# EAGLE design Stamp 1d (EAGLE 6.2)

## Sheet 1 of 5
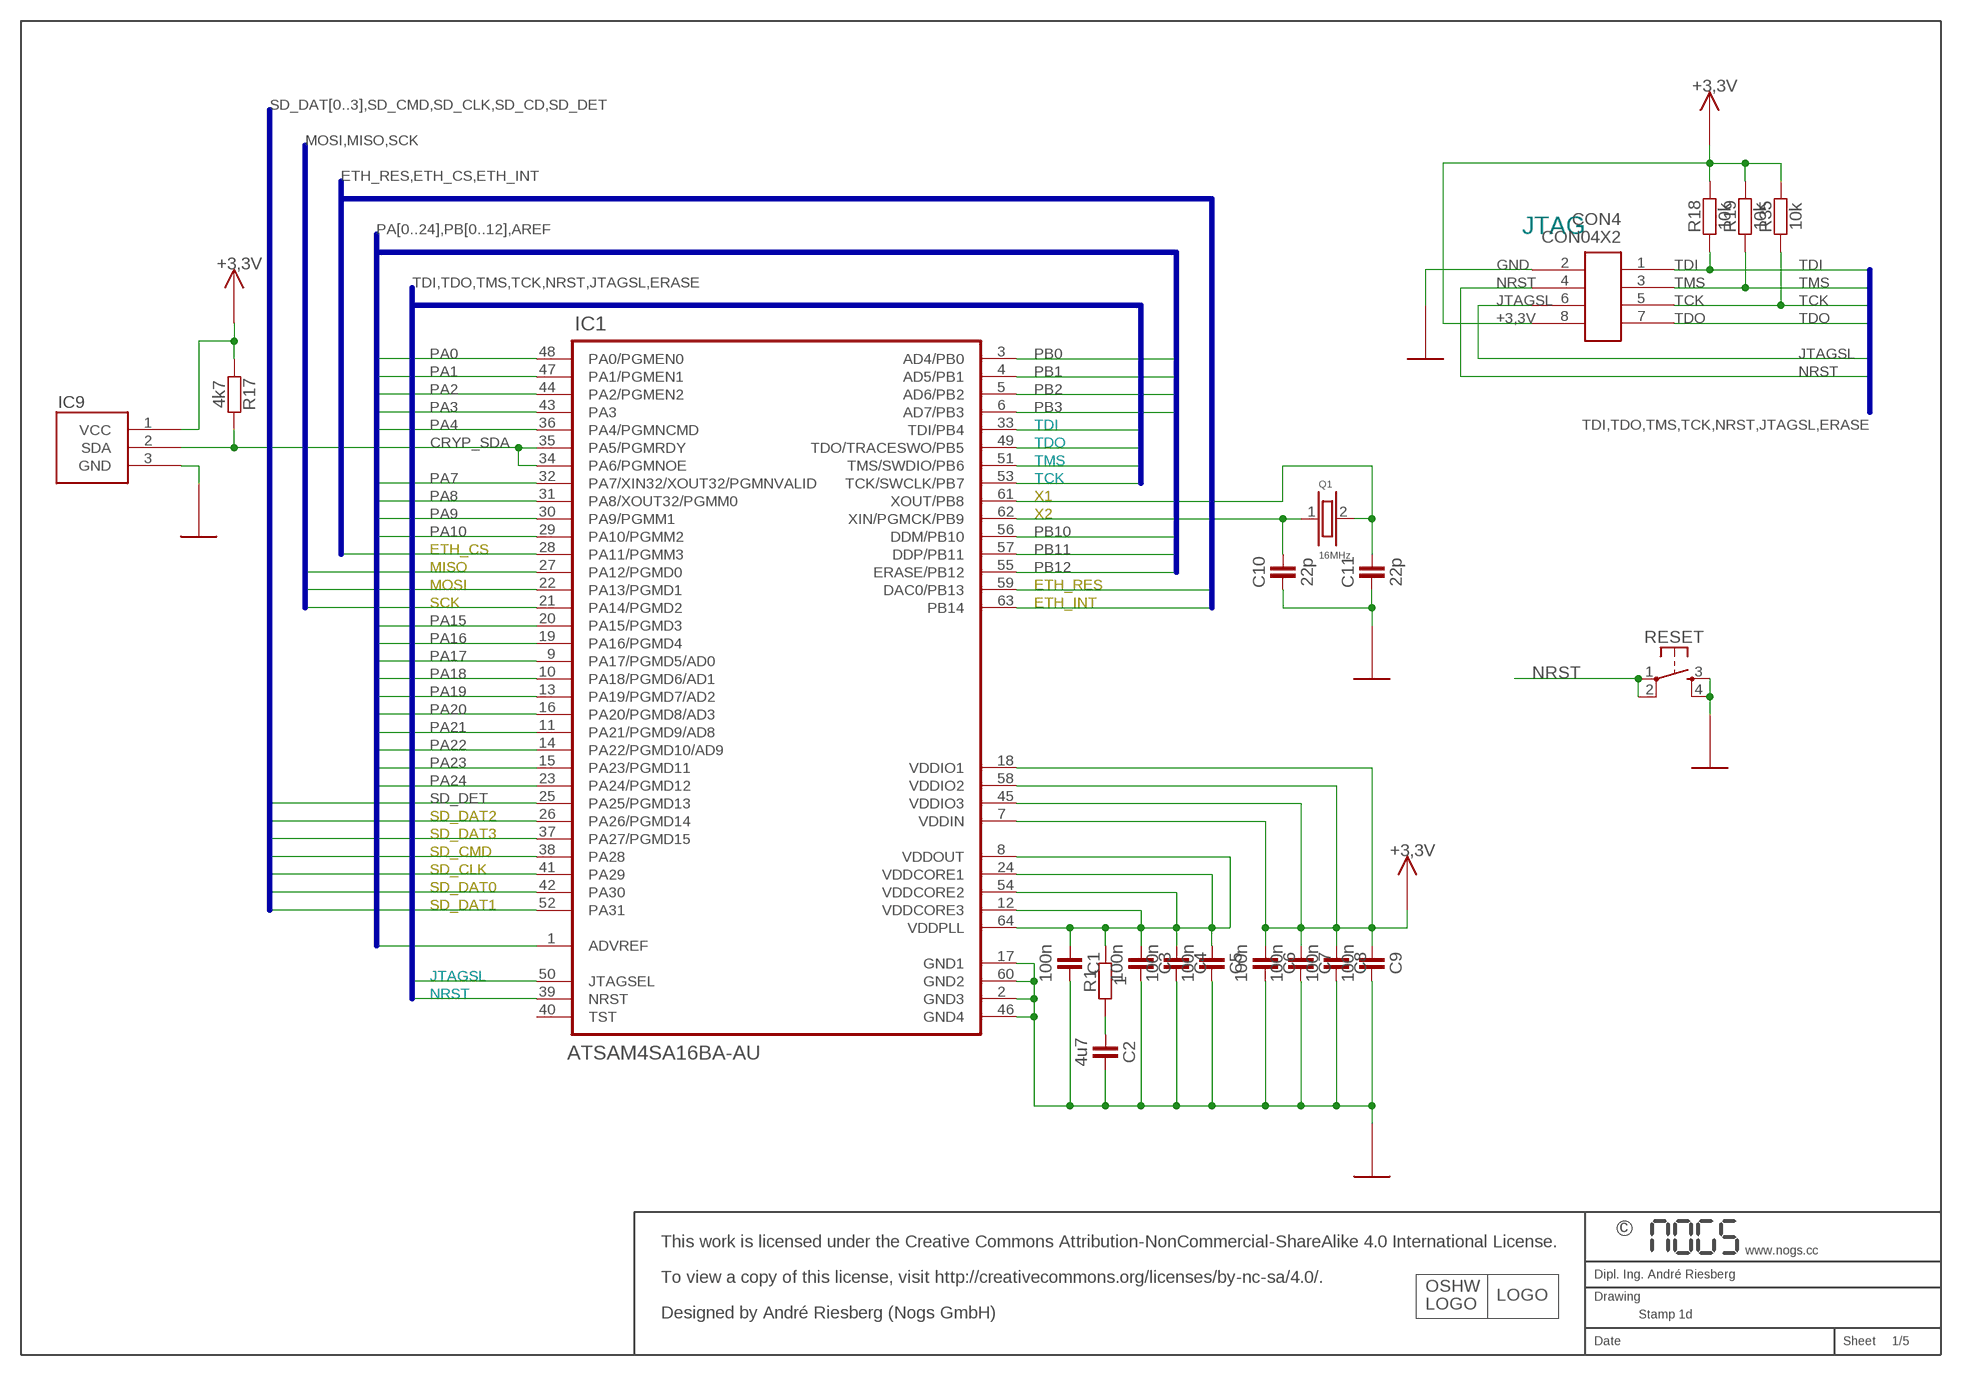
[diagram p0: schematic, sheet 1]

### Parts
C1  100n  CAPACITOR-C0402  [R0402]
C2  4u7  CAPACITOR-C0402  [R0402]
C3  100n  CAPACITOR-C0402  [R0402]
C4  100n  CAPACITOR-C0402  [R0402]
C5  100n  CAPACITOR-C0402  [R0402]
C6  100n  CAPACITOR-C0402  [R0402]
C7  100n  CAPACITOR-C0402  [R0402]
C8  100n  CAPACITOR-C0402  [R0402]
C9  100n  CAPACITOR-C0402  [R0402]
C10  22p  CAPACITOR-C0402  [R0402]
C11  22p  CAPACITOR-C0402  [R0402]
CON4  CON04X2  [CON04X2]
IC1  ATSAM4SA16BA-AU  ATSAM4S16BA-AU  [QFP50P1200X1200X160-64N]
IC9  SHA240-1  [SOT-23]
Q1  16MHz  Q@2  [TXC1]
R1  1  RESISTOR-R0402  [R0402]
R17  4k7  RESISTOR-R0402  [R0402]
R18  10k  RESISTOR-R0402  [R0402]
R19  10k  RESISTOR-R0402  [R0402]
R35  10k  RESISTOR-R0402  [R0402]
RESET  SW-TACTILE-PTS840P  [SW_PTS840P]

### Nets
+1,8V_A: C1.1 C3.1 C4.1 C5.1 IC1.8(VDDOUT) IC1.12(VDDCORE3) IC1.24(VDDCORE1) IC1.54(VDDCORE2) IC1.64(VDDPLL) R1.2
+3,3V: C6.1 C7.1 C8.1 C9.1 CON4.8 IC1.7(VDDIN) IC1.18(VDDIO1) IC1.45(VDDIO3) IC1.58(VDDIO2) IC9.1(VCC) R17.1 R18.2 R19.2 R35.2 ; also sheet 2,3,4,5
AREF: IC1.1(ADVREF) ; also sheet 5
CRYP_SDA: IC1.34(PA6/PGMNOE) IC1.35(PA5/PGMRDY) IC9.2(SDA) R17.2
ETH_CS: IC1.28(PA11/PGMM3) ; also sheet 2
ETH_INT: IC1.63(PB14) ; also sheet 2
ETH_RES: IC1.59(DAC0/PB13) ; also sheet 2
GND: C1.2 C2.2 C3.2 C4.2 C5.2 C6.2 C7.2 C8.2 C9.2 C10.1 C11.1 CON4.2 IC1.2(GND3) IC1.17(GND1) IC1.46(GND4) IC1.60(GND2) IC9.3(GND) RESET.3(S1) RESET.4(S2) ; also sheet 2,3,4,5
JTAGSL: CON4.6 IC1.50(JTAGSEL)
MISO: IC1.27(PA12/PGMD0) ; also sheet 2
MOSI: IC1.22(PA13/PGMD1) ; also sheet 2
N$10: C2.1 R1.1
NRST: CON4.4 IC1.39(NRST) RESET.1 RESET.2
PA0: IC1.48(PA0/PGMEN0) ; also sheet 5
PA1: IC1.47(PA1/PGMEN1) ; also sheet 5
PA2: IC1.44(PA2/PGMEN2) ; also sheet 5
PA3: IC1.43(PA3) ; also sheet 5
PA4: IC1.36(PA4/PGMNCMD) ; also sheet 5
PA7: IC1.32(PA7/XIN32/XOUT32/PGMNVALID) ; also sheet 5
PA8: IC1.31(PA8/XOUT32/PGMM0) ; also sheet 5
PA9: IC1.30(PA9/PGMM1) ; also sheet 5
PA10: IC1.29(PA10/PGMM2) ; also sheet 5
PA15: IC1.20(PA15/PGMD3) ; also sheet 5
PA16: IC1.19(PA16/PGMD4) ; also sheet 5
PA17: IC1.9(PA17/PGMD5/AD0) ; also sheet 5
PA18: IC1.10(PA18/PGMD6/AD1) ; also sheet 5
PA19: IC1.13(PA19/PGMD7/AD2) ; also sheet 5
PA20: IC1.16(PA20/PGMD8/AD3) ; also sheet 5
PA21: IC1.11(PA21/PGMD9/AD8) ; also sheet 5
PA22: IC1.14(PA22/PGMD10/AD9) ; also sheet 5
PA23: IC1.15(PA23/PGMD11) ; also sheet 5
PA24: IC1.23(PA24/PGMD12) ; also sheet 5
PB0: IC1.3(AD4/PB0) ; also sheet 5
PB1: IC1.4(AD5/PB1) ; also sheet 5
PB2: IC1.5(AD6/PB2) ; also sheet 5
PB3: IC1.6(AD7/PB3) ; also sheet 5
PB10: IC1.56(DDM/PB10) ; also sheet 5
PB11: IC1.57(DDP/PB11) ; also sheet 5
PB12: IC1.55(ERASE/PB12) ; also sheet 5
SCK: IC1.21(PA14/PGMD2) ; also sheet 2
SD_CLK: IC1.41(PA29) ; also sheet 3
SD_CMD: IC1.38(PA28) ; also sheet 3
SD_DAT0: IC1.42(PA30) ; also sheet 3
SD_DAT1: IC1.52(PA31) ; also sheet 3
SD_DAT2: IC1.26(PA26/PGMD14) ; also sheet 3
SD_DAT3: IC1.37(PA27/PGMD15) ; also sheet 3
SD_DET: IC1.25(PA25/PGMD13) ; also sheet 3
TCK: CON4.5 IC1.53(TCK/SWCLK/PB7) R35.1
TDI: CON4.1 IC1.33(TDI/PB4) R18.1
TDO: CON4.7 IC1.49(TDO/TRACESWO/PB5)
TMS: CON4.3 IC1.51(TMS/SWDIO/PB6) R19.1
X1: C11.2 IC1.61(XOUT/PB8) Q1.2
X2: C10.2 IC1.62(XIN/PGMCK/PB9) Q1.1
Unconnected: IC1.40(TST)

### Buses
TDI,TDO,TMS,TCK,NRST,JTAGSL,ERASE
PA[0..24],PB[0..12],AREF
MOSI,MISO,SCK
ETH_RES,ETH_CS,ETH_INT
SD_DAT[0..3],SD_CMD,SD_CLK,SD_CD,SD_DET

### Notes on the sheet
- JTAG
- F1841946
- This work is licensed under the Creative Commons Attribution-NonCommercial-ShareAlike 4.0 International License.
- To view a copy of this license, visit http://creativecommons.org/licenses/by-nc-sa/4.0/.
- OSHW
- LOGO
- LOGO
- Designed by André Riesberg (Nogs GmbH)

## Sheet 2 of 5
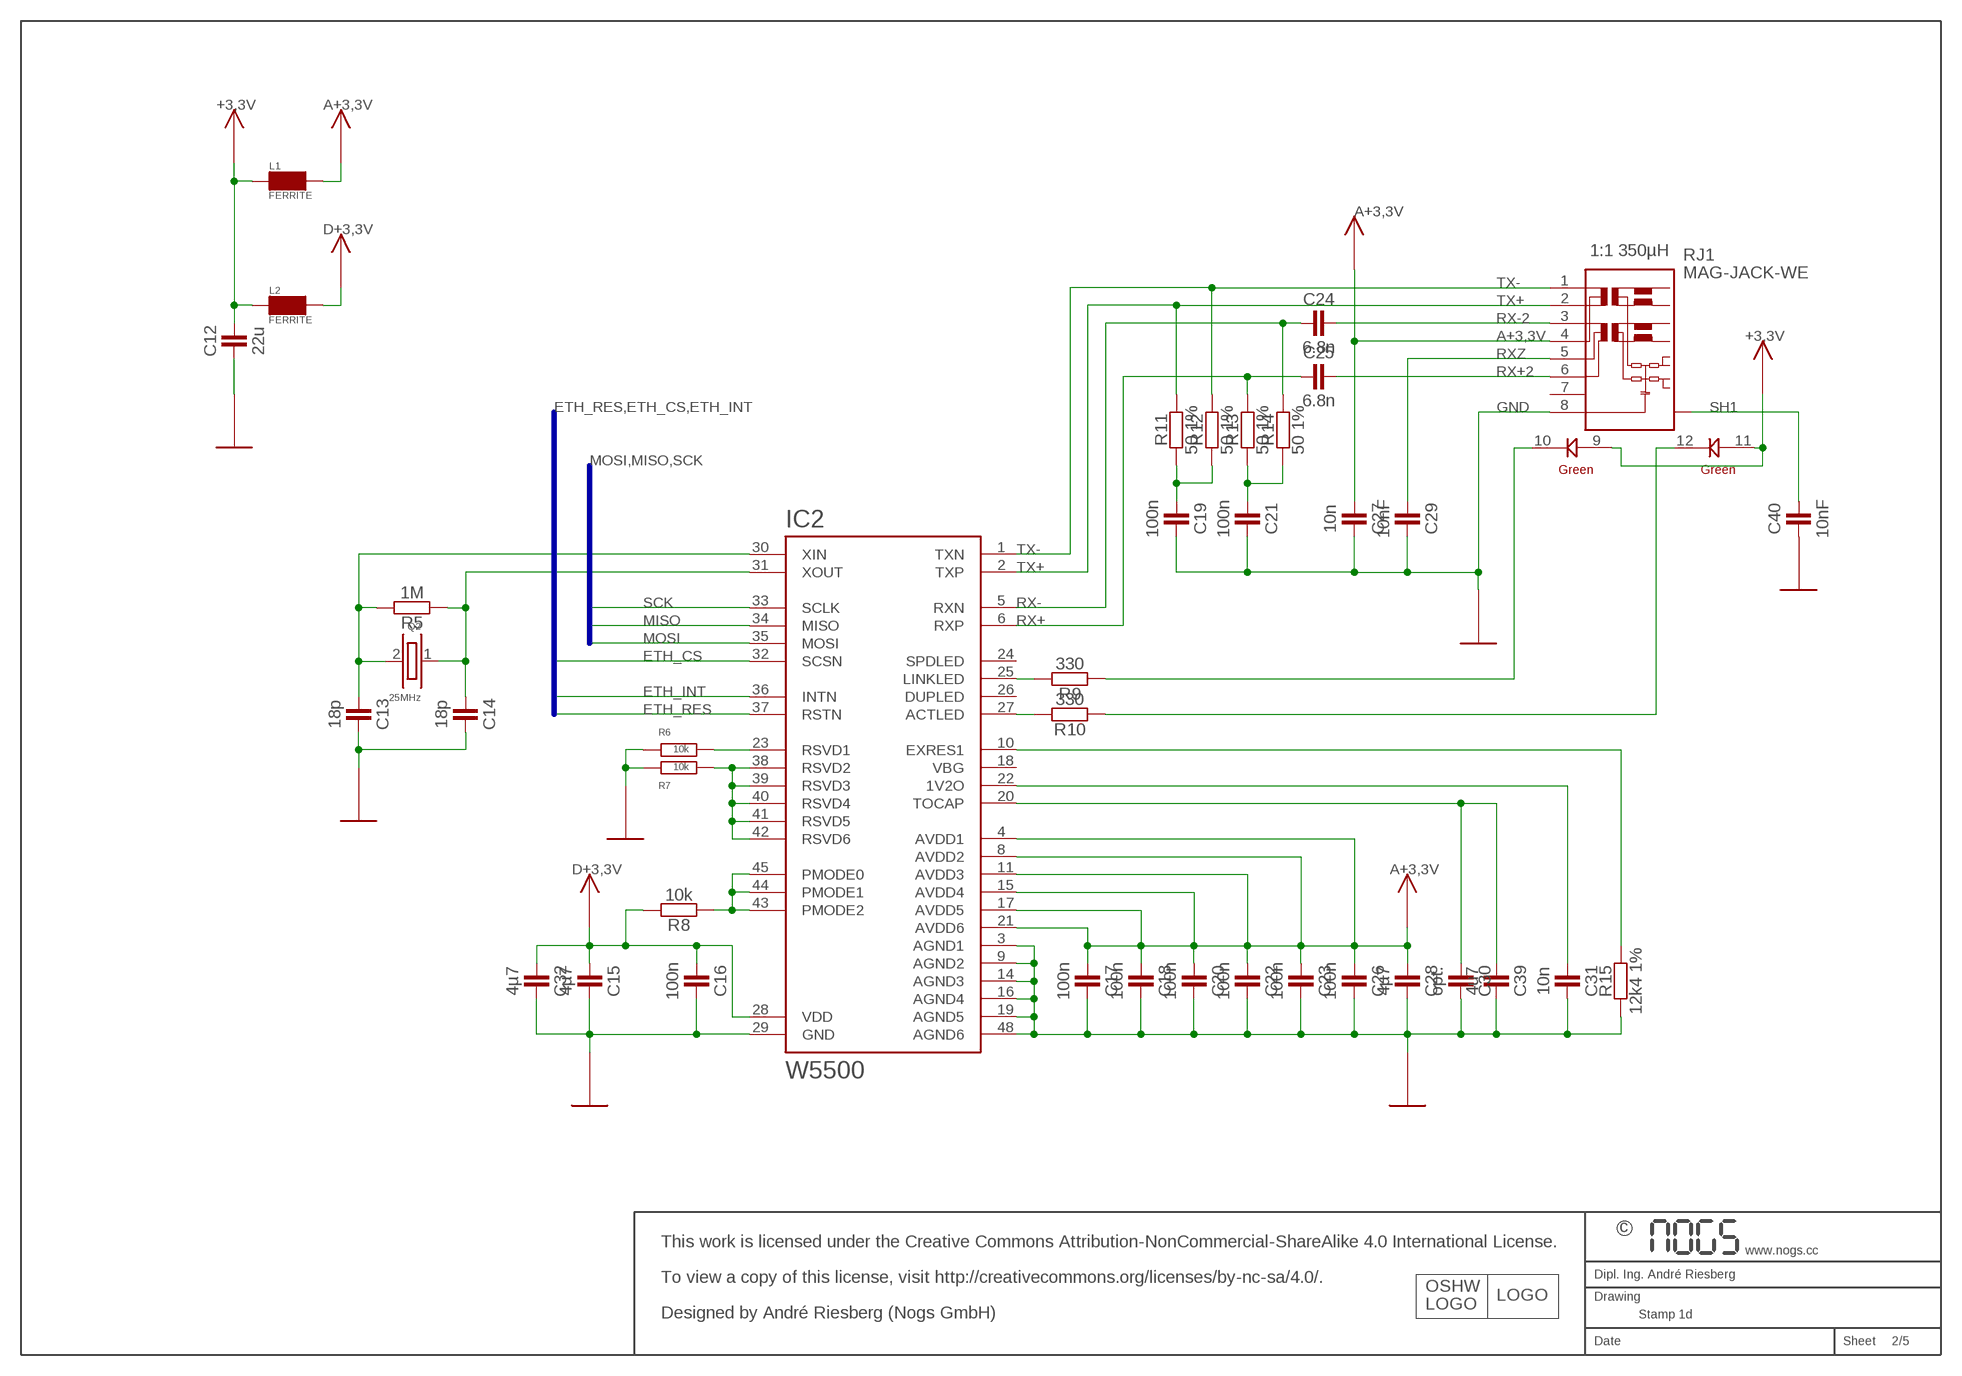
[diagram p1: schematic, sheet 2]

### Parts
C12  22u  CAPACITOR-C1206  [R1206]
C13  18p  CAPACITOR-C0402  [R0402]
C14  18p  CAPACITOR-C0402  [R0402]
C15  4µ7  CAPACITOR-C0402  [R0402]
C16  100n  CAPACITOR-C0402  [R0402]
C17  100n  CAPACITOR-C0402  [R0402]
C18  100n  CAPACITOR-C0402  [R0402]
C19  100n  CAPACITOR-C0402  [R0402]
C20  100n  CAPACITOR-C0402  [R0402]
C21  100n  CAPACITOR-C0402  [R0402]
C22  100n  CAPACITOR-C0402  [R0402]
C23  100n  CAPACITOR-C0402  [R0402]
C24  6.8n  CAPACITOR-C0402  [R0402]
C25  6.8n  CAPACITOR-C0402  [R0402]
C26  100n  CAPACITOR-C0402  [R0402]
C27  10n  CAPACITOR-C0402  [R0402]
C28  4µ7  CAPACITOR-C0402  [R0402]
C29  10nF  CAPACITOR-C0402  [R0402]
C30  opt.  CAPACITOR-C0402  [R0402]
C31  10n  CAPACITOR-C0402  [R0402]
C32  4µ7  CAPACITOR-C0402  [R0402]
C39  4u7  CAPACITOR-C0402  [R0402]
C40  10nF  CAPACITOR-C0402  [R0402]
IC2  W5500  [LQFP-48]
L1  FERRITE  L1008@2  [1206@2]
L2  FERRITE  L1008@2  [1206@2]
Q2  25MHz  Q@2  [TXC1]
R5  1M  RESISTOR-R0402  [R0402]
R6  10k  RESISTOR-R0402  [R0402]
R7  10k  RESISTOR-R0402  [R0402]
R8  10k  RESISTOR-R0402  [R0402]
R9  330  RESISTOR-R0402  [R0402]
R10  330  RESISTOR-R0402  [R0402]
R11  50 1%  RESISTOR-R0402  [R0402]
R12  50 1%  RESISTOR-R0402  [R0402]
R13  50 1%  RESISTOR-R0402  [R0402]
R14  50 1%  RESISTOR-R0402  [R0402]
R15  12k4 1%  RESISTOR-R0402  [R0402]
RJ1  MAG-JACK-WE  [7499011121A]

### Nets
+3,3V: C12.2 L1.1 L2.1 RJ1.9 RJ1.11 ; also sheet 1,3,4,5
A+3,3V: C17.1 C18.1 C20.1 C22.1 C23.1 C26.1 C27.1 C28.1 IC2.4(AVDD1) IC2.8(AVDD2) IC2.11(AVDD3) IC2.15(AVDD4) IC2.17(AVDD5) IC2.21(AVDD6) L1.2 RJ1.4 ; supply symbol labelled +3,3V
D+3,3V: C15.1 C16.1 C32.1 IC2.28(VDD) L2.2 R8.2 ; supply symbol labelled +3,3V
ETH_CS: IC2.32(SCSN) ; also sheet 1
ETH_INT: IC2.36(INTN) ; also sheet 1
ETH_RES: IC2.37(RSTN) ; also sheet 1
GND: C12.1 C13.1 C14.1 C15.2 C16.2 C17.2 C18.2 C19.2 C20.2 C21.2 C22.2 C23.2 C26.2 C27.2 C28.2 C29.2 C30.2 C31.2 C32.2 C39.2 C40.1 IC2.3(AGND1) IC2.9(AGND2) IC2.14(AGND3) IC2.16(AGND4) IC2.19(AGND5) IC2.29(GND) IC2.48(AGND6) R6.2 R7.2 R15.1 RJ1.8 ; also sheet 1,3,4,5
MISO: IC2.34(MISO) ; also sheet 1
MOSI: IC2.35(MOSI) ; also sheet 1
N$1: IC2.25(LINKLED) R9.2
N$2: IC2.43(PMODE2) IC2.44(PMODE1) IC2.45(PMODE0) R8.1
N$4: C14.2 IC2.31(XOUT) Q2.1 R5.2
N$5: C13.2 IC2.30(XIN) Q2.2 R5.1
N$6: IC2.23(RSVD1) R6.1
N$7: IC2.27(ACTLED) R10.2
N$11: IC2.38(RSVD2) IC2.39(RSVD3) IC2.40(RSVD4) IC2.41(RSVD5) IC2.42(RSVD6) R7.1
N$16: IC2.10(EXRES1) R15.2
N$17: C31.1 IC2.22(1V2O)
N$18: C30.1 C39.1 IC2.20(TOCAP)
N$19: C19.1 R11.1 R12.1
N$21: C21.1 R13.1 R14.1
N$26: R9.1 RJ1.10
N$27: R10.1 RJ1.12
RX+: C25.1 IC2.6(RXP) R13.2
RX+2: C25.2 RJ1.6
RX-: C24.1 IC2.5(RXN) R14.2
RX-2: C24.2 RJ1.3
RXZ: C29.1 RJ1.5
SCK: IC2.33(SCLK) ; also sheet 1
SH1: C40.2 RJ1.SH@1(S) RJ1.SH@2(S)
TX+: IC2.2(TXP) R11.2 RJ1.2
TX-: IC2.1(TXN) R12.2 RJ1.1
Unconnected: IC2.24(SPDLED) IC2.26(DUPLED) RJ1.7

### Buses
MOSI,MISO,SCK
ETH_RES,ETH_CS,ETH_INT

### Notes on the sheet
- FAIR RITE
- 1:1 350µH
- 2512067007Y3
- F1841954
- This work is licensed under the Creative Commons Attribution-NonCommercial-ShareAlike 4.0 International License.
- To view a copy of this license, visit http://creativecommons.org/licenses/by-nc-sa/4.0/.
- OSHW
- LOGO
- LOGO
- Designed by André Riesberg (Nogs GmbH)

## Sheet 3 of 5
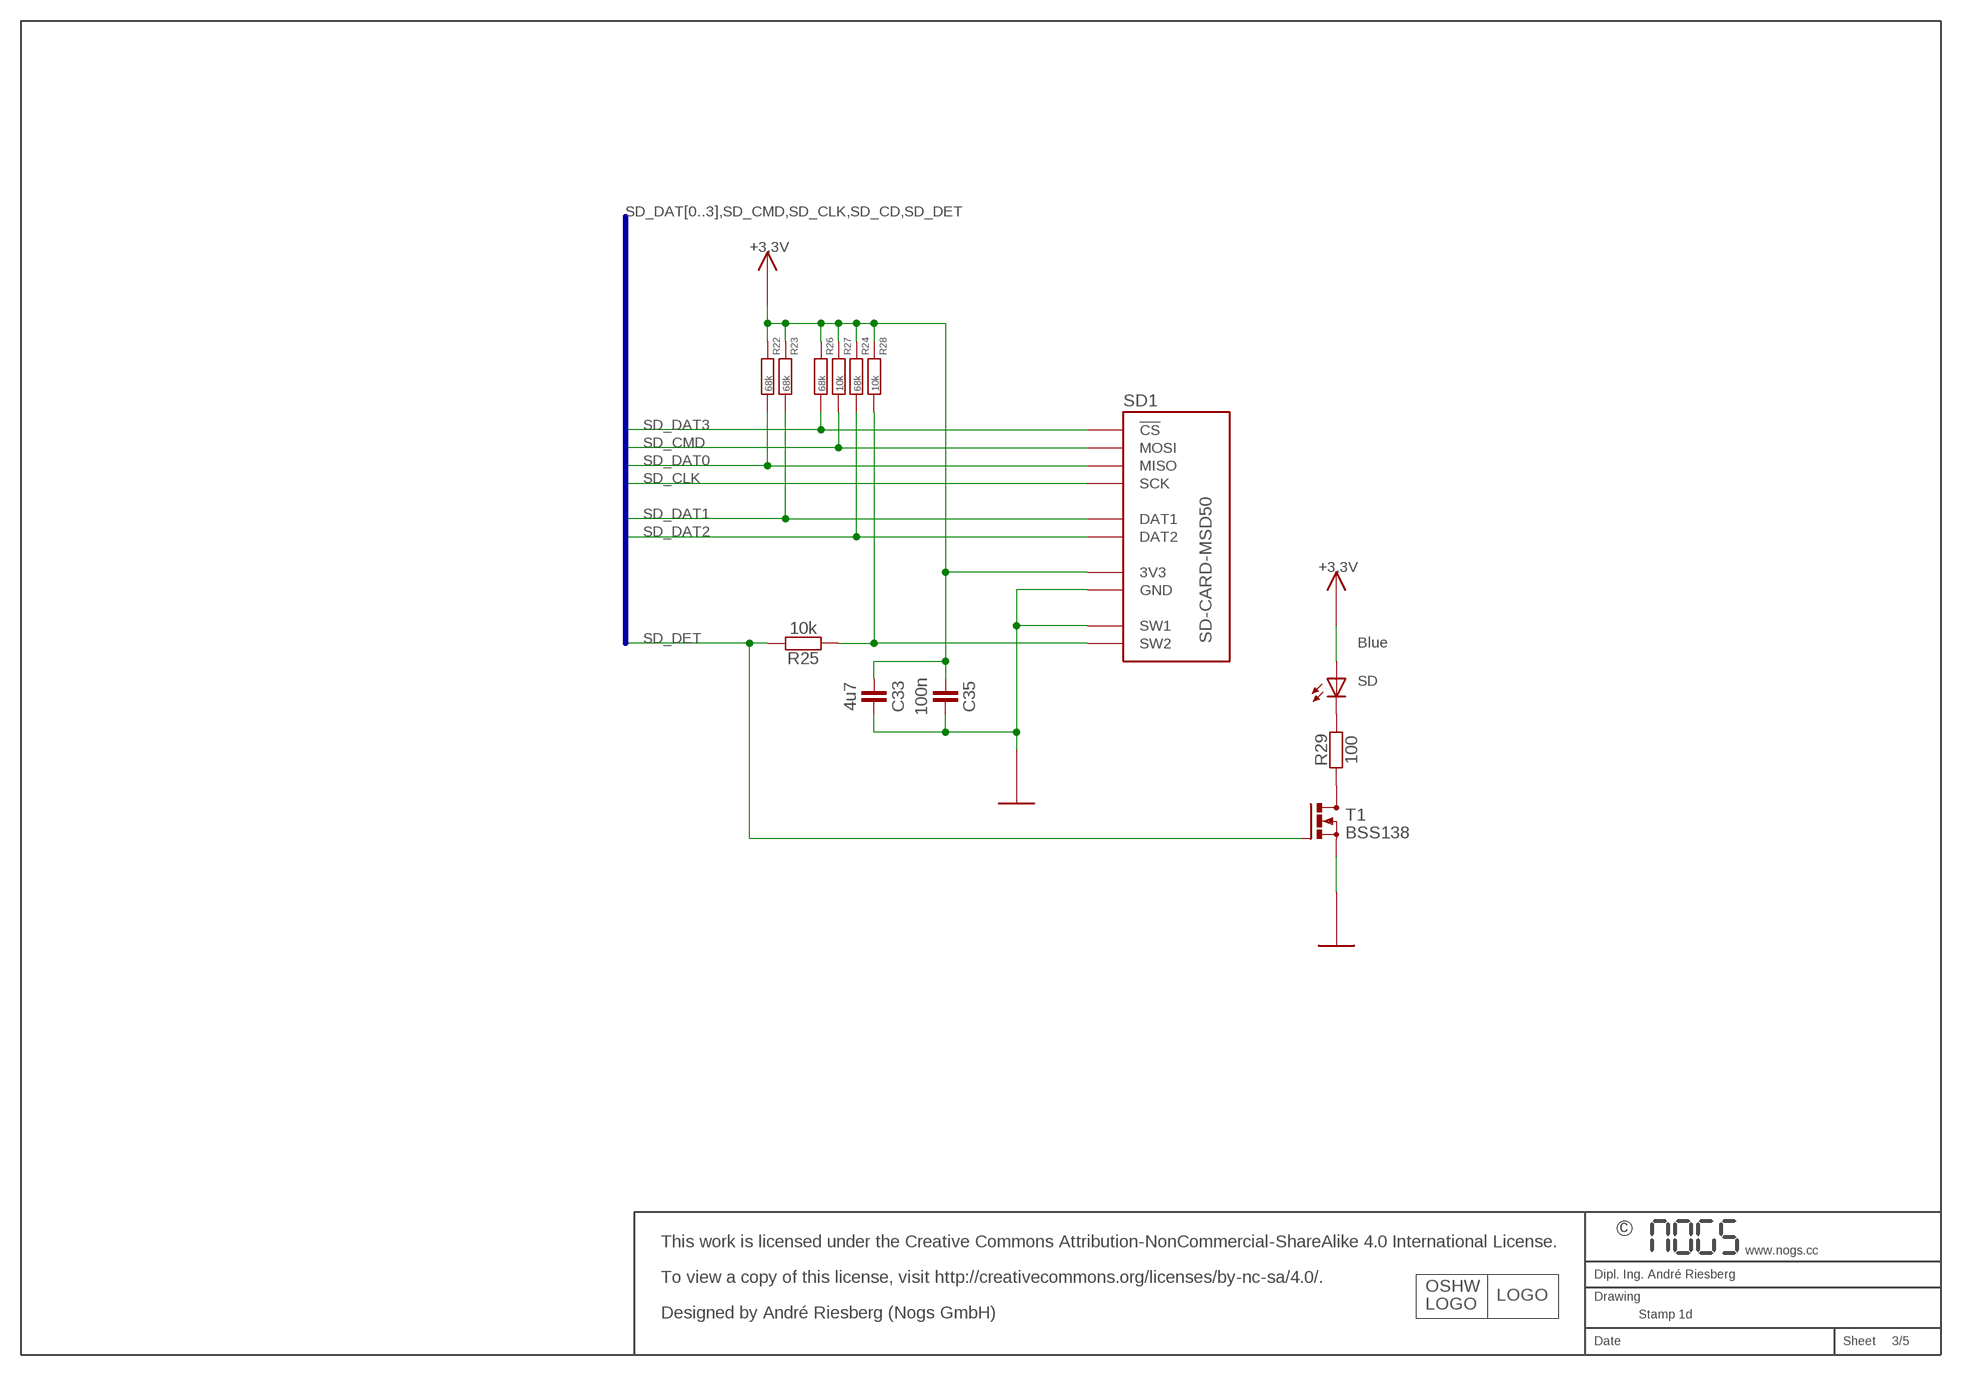
[diagram p2: schematic, sheet 3]

### Parts
C33  4u7  CAPACITOR-C0402  [R0402]
C35  100n  CAPACITOR-C0402  [R0402]
R22  68k  RESISTOR-R0402  [R0402]
R23  68k  RESISTOR-R0402  [R0402]
R24  68k  RESISTOR-R0402  [R0402]
R25  10k  RESISTOR-R0402  [R0402]
R26  68k  RESISTOR-R0402  [R0402]
R27  10k  RESISTOR-R0402  [R0402]
R28  10k  RESISTOR-R0402  [R0402]
R29  100  RESISTOR-R0402  [R0402]
SD  Blue  LED-0603  [LED_0603]
SD1  SD-CARD-MSD50  [SD_5031821853]
T1  BSS138  MOSFET-N-SOT23  [SOT23]

### Nets
+3,3V: C33.1 C35.1 R22.2 R23.2 R24.2 R26.2 R27.2 R28.2 SD1.VCC(3V3) SD.A ; also sheet 1,2,4,5
GND: C33.2 C35.2 SD1.GND SD1.SW1 T1.2(S) ; also sheet 1,2,4,5
N$3: R29.1 T1.3(D)
N$40: R29.2 SD.C
N$41: R25.1 R28.1 SD1.SW2
SD_CLK: SD1.SCK ; also sheet 1
SD_CMD: R27.1 SD1.MOSI ; also sheet 1
SD_DAT0: R22.1 SD1.MISO ; also sheet 1
SD_DAT1: R23.1 SD1.DAT1 ; also sheet 1
SD_DAT2: R24.1 SD1.DAT2 ; also sheet 1
SD_DAT3: R26.1 SD1.CS(!CS) ; also sheet 1
SD_DET: R25.2 T1.1(G) ; also sheet 1

### Buses
SD_DAT[0..3],SD_CMD,SD_CLK,SD_CD,SD_DET

### Notes on the sheet
- RESET
- This work is licensed under the Creative Commons Attribution-NonCommercial-ShareAlike 4.0 International License.
- To view a copy of this license, visit http://creativecommons.org/licenses/by-nc-sa/4.0/.
- OSHW
- LOGO
- LOGO
- Designed by André Riesberg (Nogs GmbH)

## Sheet 4 of 5
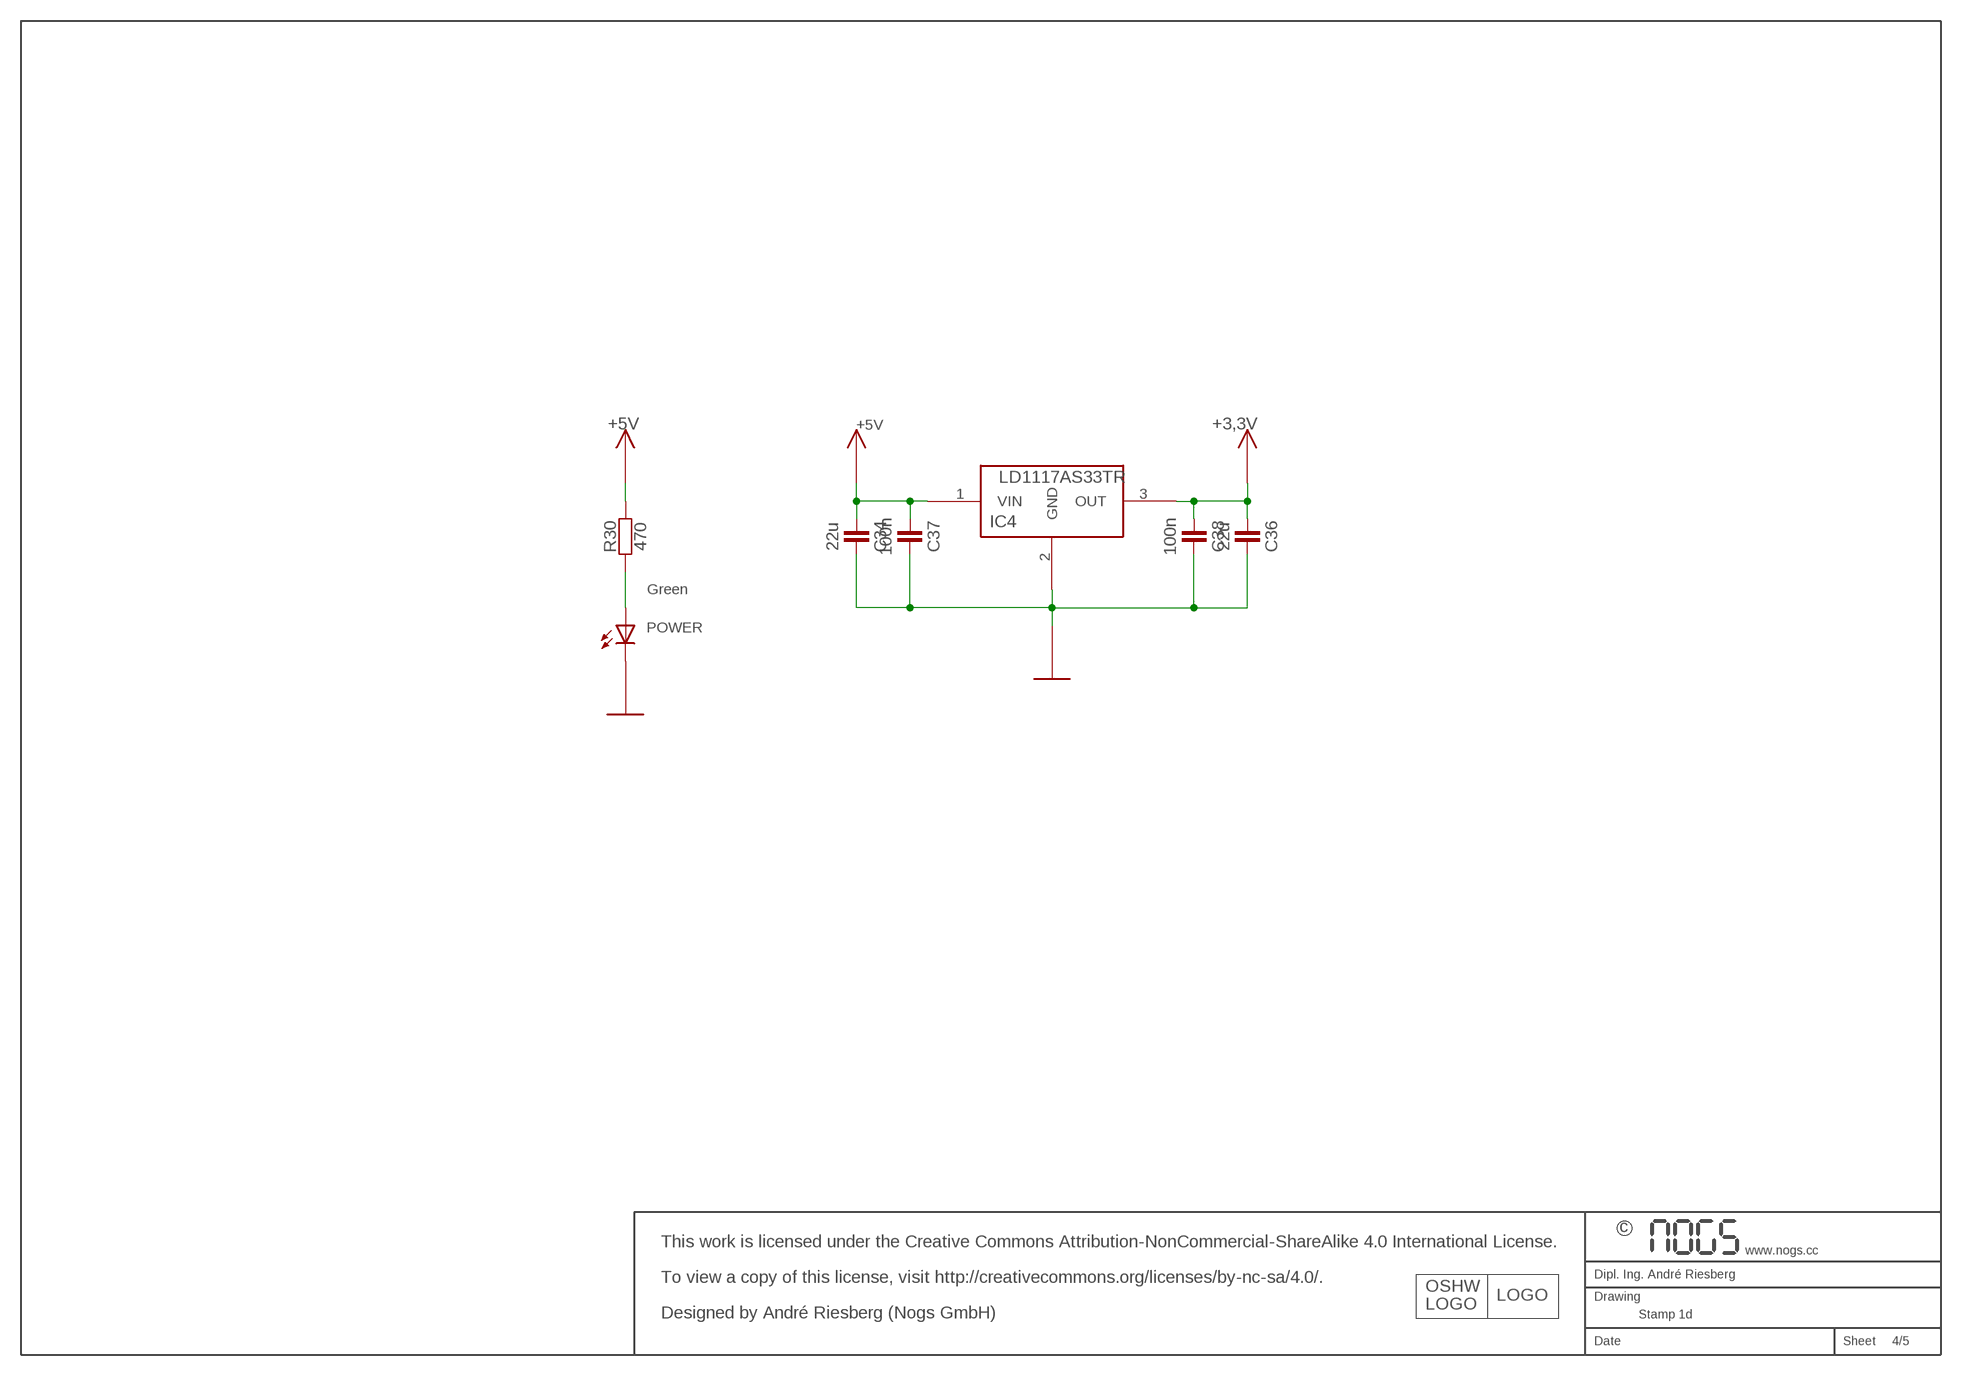
[diagram p3: schematic, sheet 4]

### Parts
C34  22u  CAPACITOR-C1206  [R1206]
C36  22u  CAPACITOR-C1206  [R1206]
C37  100n  CAPACITOR-C0402  [R0402]
C38  100n  CAPACITOR-C0402  [R0402]
IC4  LD1117AS33TR  LM78XX  [SOT-223B]
POWER  Green  LED-0603  [LED_0603]
R30  470  RESISTOR-R0402  [R0402]

### Nets
+3,3V: C36.1 C38.1 IC4.3(OUT) ; also sheet 1,2,3,5
+5V: C34.1 C37.1 IC4.1(VIN) R30.2 ; also sheet 5
GND: C34.2 C36.2 C37.2 C38.2 IC4.2(GND) POWER.C ; also sheet 1,2,3,5
N$39: POWER.A R30.1

### Notes on the sheet
- This work is licensed under the Creative Commons Attribution-NonCommercial-ShareAlike 4.0 International License.
- To view a copy of this license, visit http://creativecommons.org/licenses/by-nc-sa/4.0/.
- OSHW
- LOGO
- LOGO
- Designed by André Riesberg (Nogs GmbH)

## Sheet 5 of 5
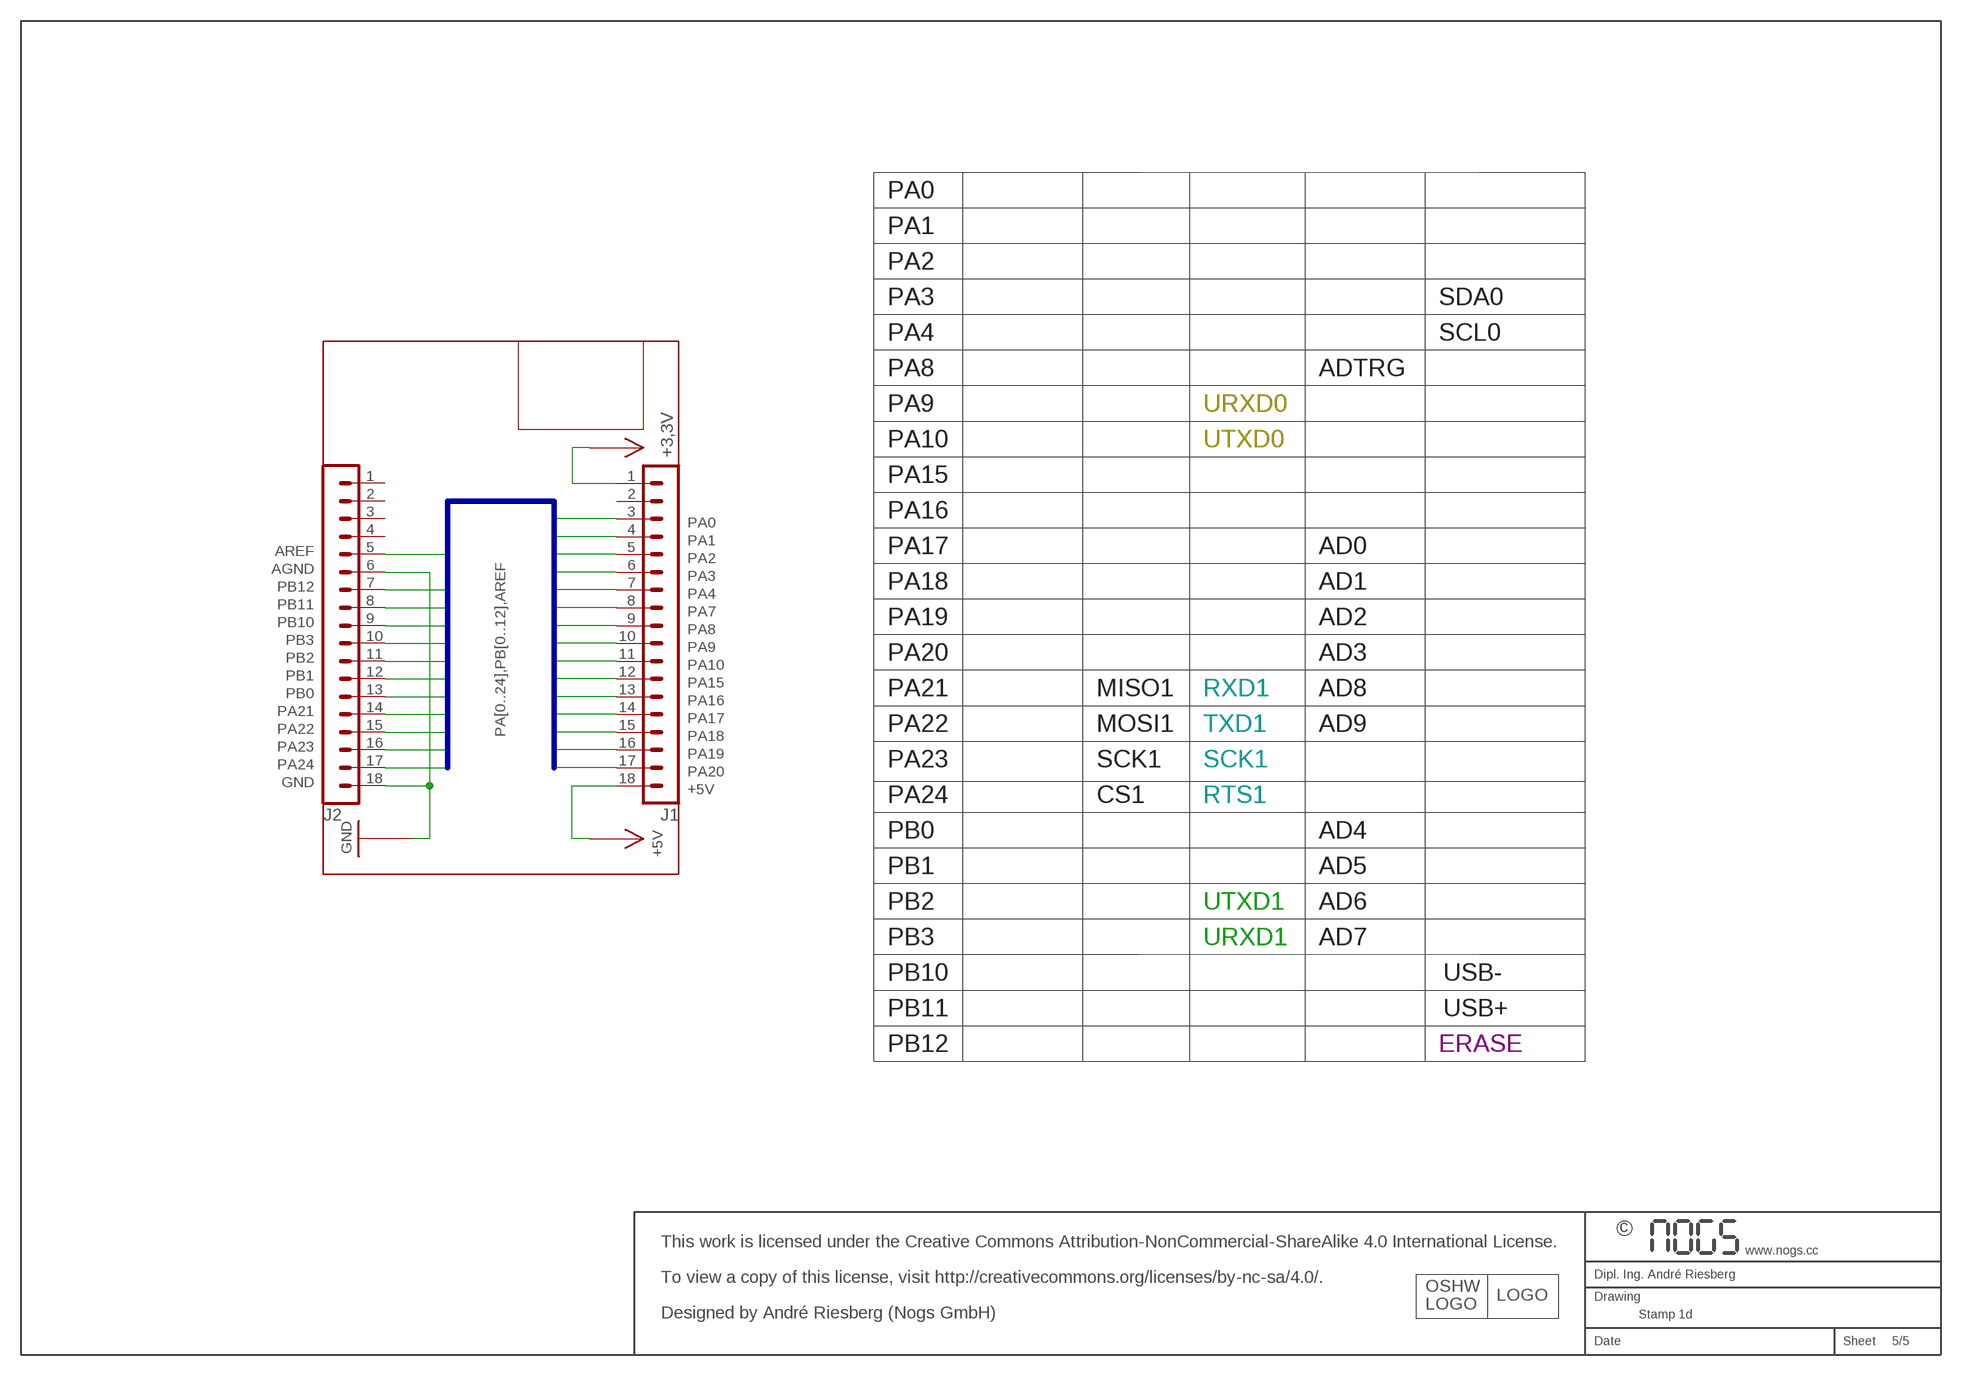
[diagram p4: schematic, sheet 5]

### Parts
J1  MA18-1  [MA18-1]
J2  MA18-1  [MA18-1]

### Nets
+3,3V: J1.1 ; also sheet 1,2,3,4
+5V: J1.18 ; also sheet 4
AREF: J2.5 ; also sheet 1
GND: J2.6 J2.18 ; also sheet 1,2,3,4
PA0: J1.3 ; also sheet 1
PA1: J1.4 ; also sheet 1
PA2: J1.5 ; also sheet 1
PA3: J1.6 ; also sheet 1
PA4: J1.7 ; also sheet 1
PA7: J1.8 ; also sheet 1
PA8: J1.9 ; also sheet 1
PA9: J1.10 ; also sheet 1
PA10: J1.11 ; also sheet 1
PA15: J1.12 ; also sheet 1
PA16: J1.13 ; also sheet 1
PA17: J1.14 ; also sheet 1
PA18: J1.15 ; also sheet 1
PA19: J1.16 ; also sheet 1
PA20: J1.17 ; also sheet 1
PA21: J2.14 ; also sheet 1
PA22: J2.15 ; also sheet 1
PA23: J2.16 ; also sheet 1
PA24: J2.17 ; also sheet 1
PB0: J2.13 ; also sheet 1
PB1: J2.12 ; also sheet 1
PB2: J2.11 ; also sheet 1
PB3: J2.10 ; also sheet 1
PB10: J2.9 ; also sheet 1
PB11: J2.8 ; also sheet 1
PB12: J2.7 ; also sheet 1
Unconnected: J1.2 J2.1 J2.2 J2.3 J2.4

### Buses
PA[0..24],PB[0..12],AREF

### Notes on the sheet
- PA0
- PA1
- PA2
- PA3 | SDA0
- PA4 | SCL0
- PA8 | ADTRG
- PA9 | URXD0
- PA10 | UTXD0
- PA15
- PA16
- PA17 | AD0
- AGND
- PA18 | AD1
- PA19 | AD2
- PA20 | AD3
- PA21 | MISO1 | RXD1 | AD8
- PA22 | MOSI1 | TXD1 | AD9
- PA23 | SCK1 | SCK1
- PA24 | CS1 | RTS1
- PB0 | AD4
- PB1 | AD5
- PB2 | UTXD1 | AD6
- PB3 | URXD1 | AD7
- PB10 | USB-
- PB11 | USB+
- PB12 | ERASE
- This work is licensed under the Creative Commons Attribution-NonCommercial-ShareAlike 4.0 International License.
- To view a copy of this license, visit http://creativecommons.org/licenses/by-nc-sa/4.0/.
- OSHW
- LOGO
- LOGO
- Designed by André Riesberg (Nogs GmbH)

## Power pins joined to a net without a drawn wire
VBG: IC2.18(VBG)

## Library data of the parts
C1-C40 = we-rcl:CAPACITOR: Capacitors ...4.7uF @ 6.3V -> 0402 ...10uF @ 16V -> 0603 ...22uF @ 25V -> 0805
CON4 = CONNEC:CON04X2
IC1 = SAM4S:ATSAM4S16BA-AU: ARM-based Flash MCU,LQFP-64; MPN: ATSAM4S16BA-AU; OC_FARNELL: 2215345; OC_NEWARK: 06W2053; PACKAGE: LQFP-64; SUPPLIER: ATMEL
IC2 = WizNet:W5500
IC4 = POWER@2:LM78XX
IC9 = Atmel:SHA240-1
J1 J2 = we-con:MA18-1: Pin header
L1 L2 = SMD:L1008@2
POWER SD = we-opto:LED: LEDs
Q1 Q2 = OSCILL:Q@2
R1 R5-R15 R17-R19 R22-R30 R35 = we-rcl:RESISTOR: Resistors all kinds in 0603 and 0402
RESET = we-switch:SW-TACTILE: Tactile Switches; DIGIKEY: CKN10511DKR-ND
RJ1 = we-con:MAG-JACK
SD1 = we-con:SD-CARD: SD-Card Sockets; DIGIKEY: WM9750TR-ND
T1 = we-transistor:MOSFET-N: N-Channel MOSFET (e.g. IRLML2502, BSS138)

## Board
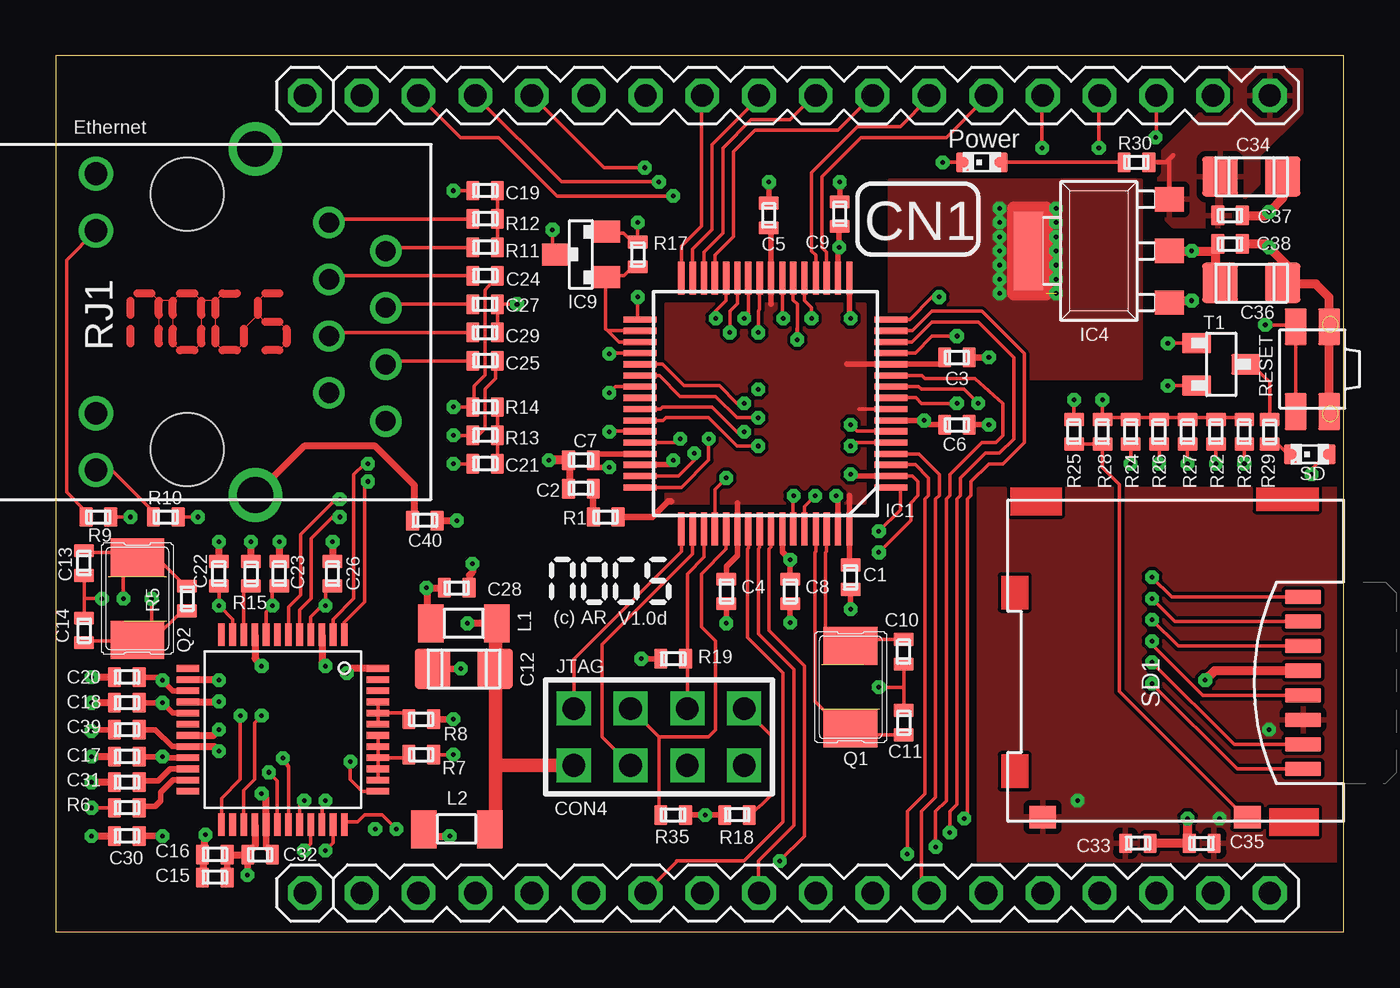
[diagram p5: board, top side]
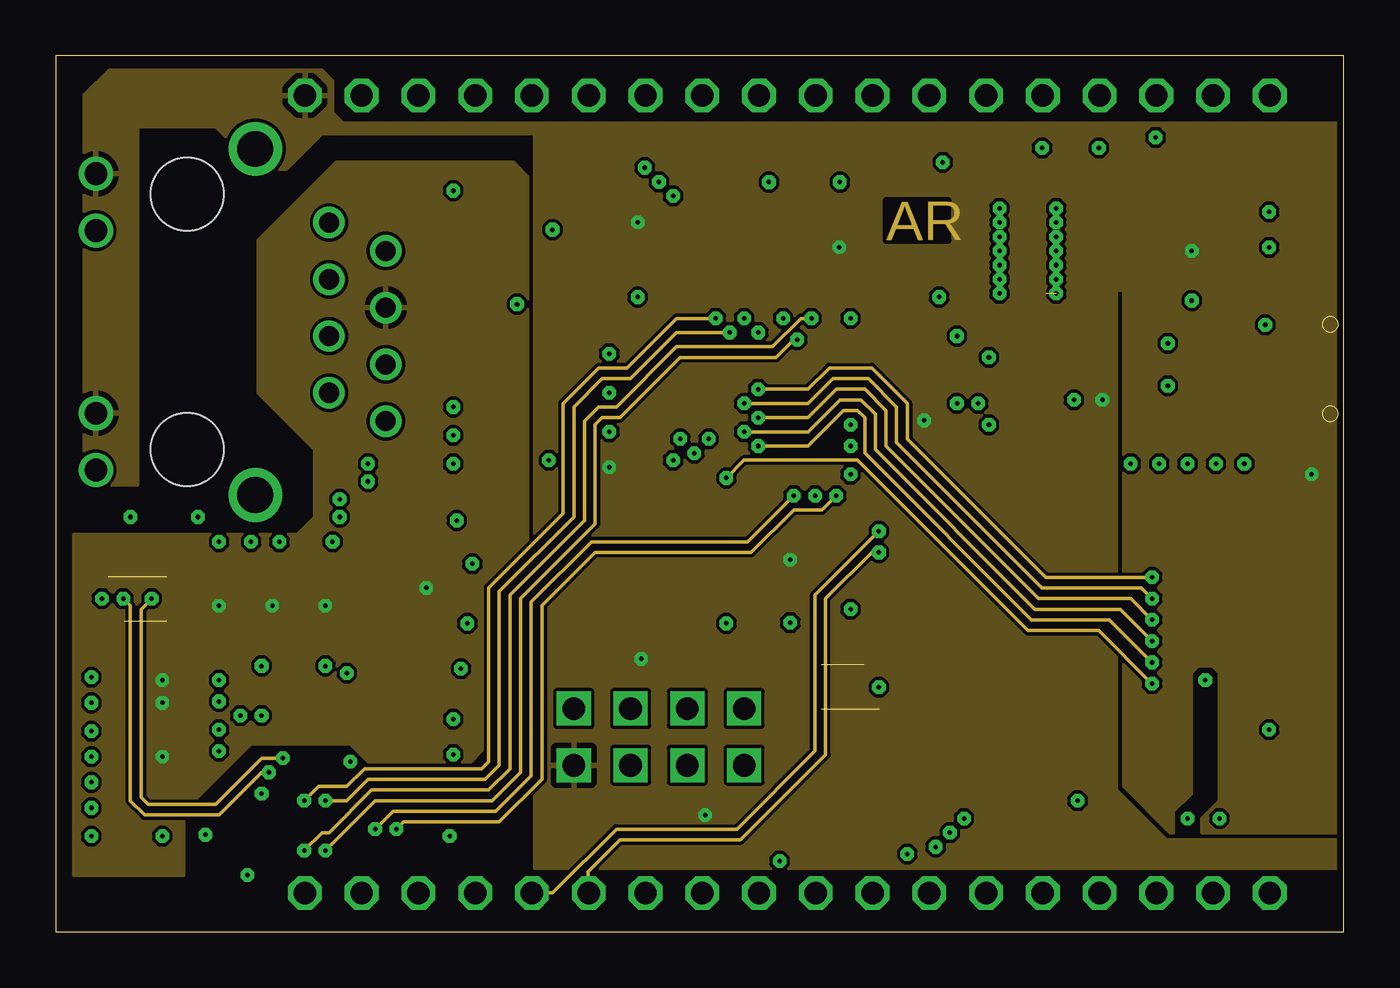
[diagram p6: board, inner layer ROUTE2]
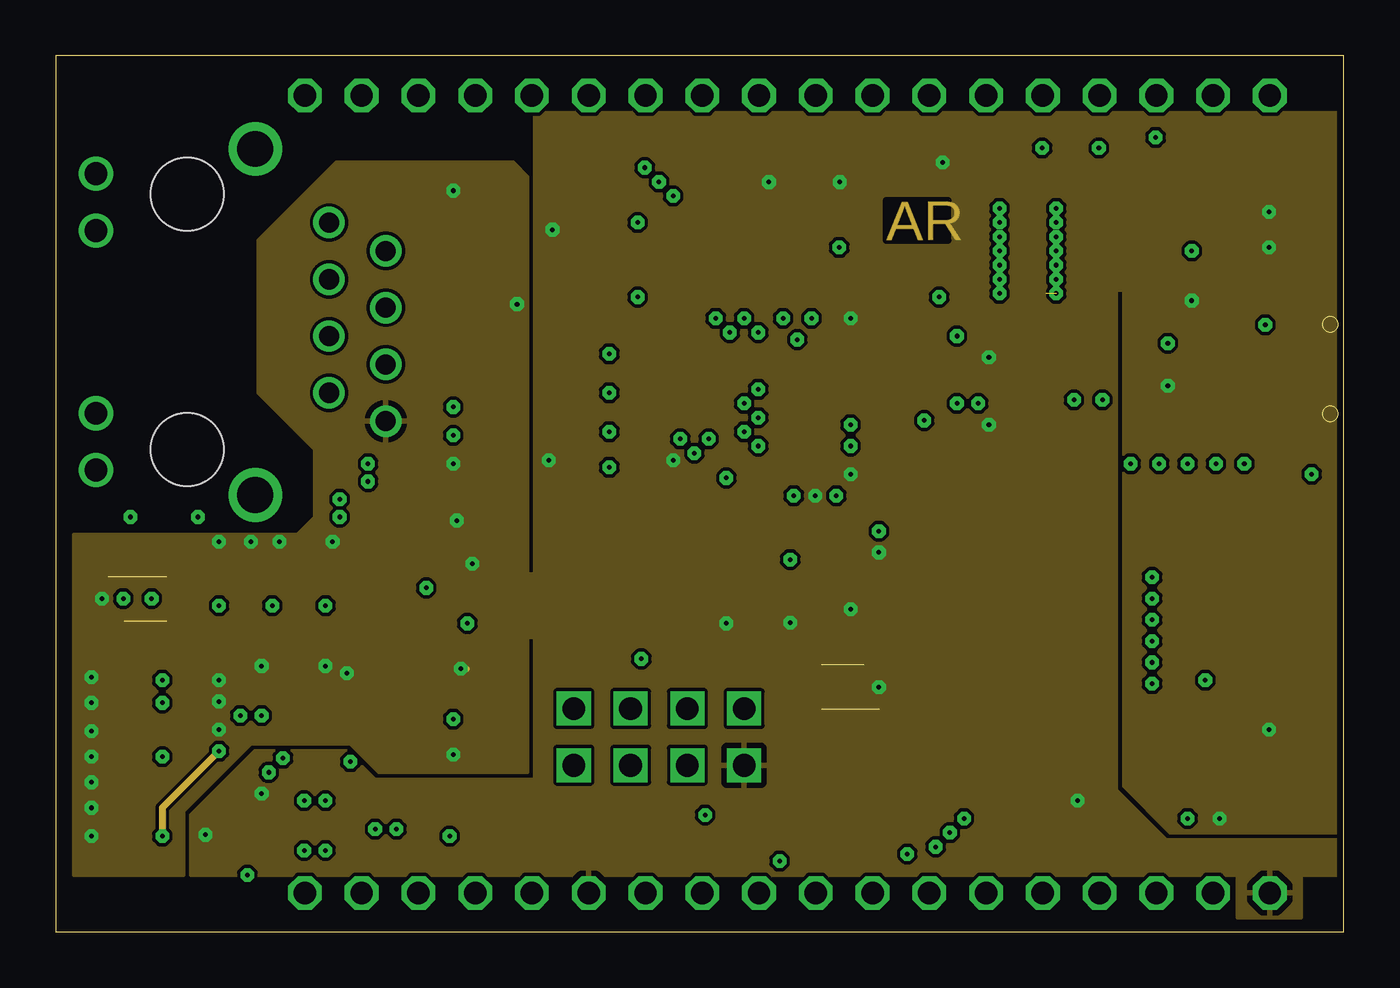
[diagram p7: board, inner layer ROUTE3]
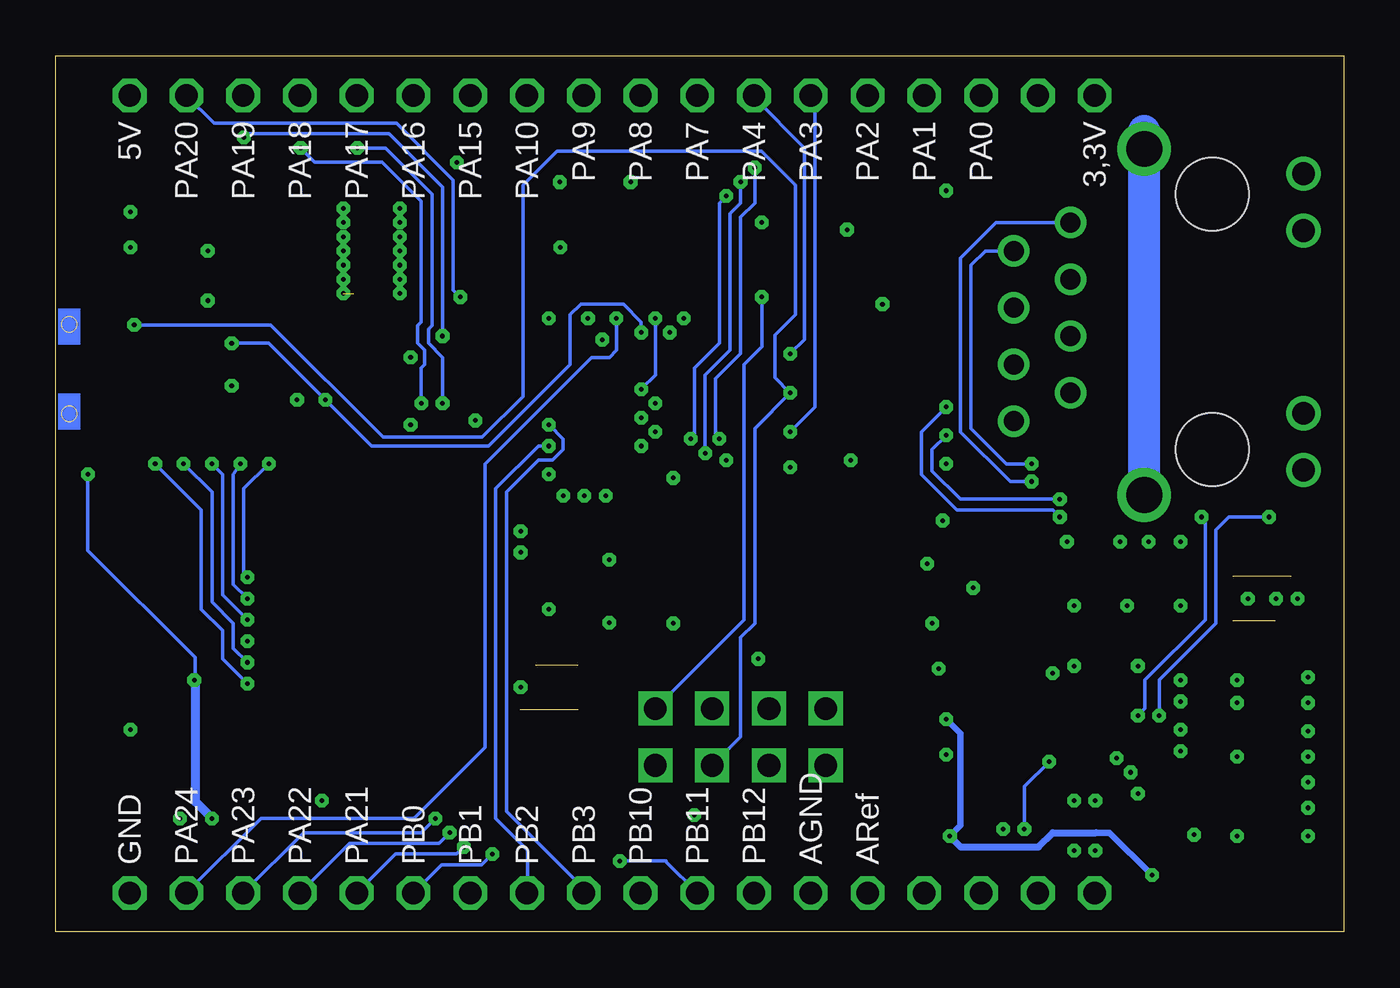
[diagram p8: board, bottom side, seen from below]

Size 57.63 x 39.21 mm. Coordinates in mm from the lower left corner, seen from the top.
Outline: 0,39.21 0,0 57.63,0 57.63,39.21 0,39.21
Copper layers (1*2+3*16): Top 0.035mm / dielectric 0.5mm / ROUTE2 0.035mm / dielectric 0.5mm / ROUTE3 0.035mm / dielectric 0.5mm / Bottom 0.035mm
Design rules: minimum track width 6mil, minimum drill 8mil, track to track 6mil, track to pad 6mil, pad to pad 6mil, via to via 6mil, smd to smd 4mil, copper to edge 0.3mm, drill to drill 0.15mm, minimum pad ring 10mil, minimum via ring 8mil, stop-mask expansion 4mil, vias tented up to drill 0.6mm, thermal gap 10mil

### Footprints (pad centres in the part's own frame; a part is rotated, then mirrored left to right if it is on the bottom)
R0402 = smd 0.9 x 0.6: 1 0,0.55; 2 0,-0.55
R1206 = smd 1.8 x 1.6: 1 0,1.4; 2 0,-1.4
CON04X2 = drill 1.016 pad 1.422 square: 1 0,0; 2 0,2.54; 3 2.54,0; 4 2.54,2.54; 5 5.08,0; 6 5.08,2.54; 7 7.62,0; 8 7.62,2.54
QFP50P1200X1200X160-64N = smd 1.473 x 0.279: 1 -5.613,3.759; 2 -5.613,3.251; 3 -5.613,2.743; 4 -5.613,2.261; 5 -5.613,1.753; 6 -5.613,1.245; 7 -5.613,0.762; 8 -5.613,0.254; 9 -5.613,-0.254; 10 -5.613,-0.762; 11 -5.613,-1.245; 12 -5.613,-1.753; 13 -5.613,-2.261; 14 -5.613,-2.743; 15 -5.613,-3.251; 16 -5.613,-3.759; 33 5.613,-3.759; 34 5.613,-3.251; 35 5.613,-2.743; 36 5.613,-2.261; 37 5.613,-1.753; 38 5.613,-1.245; 39 5.613,-0.762; 40 5.613,-0.254; 41 5.613,0.254; 42 5.613,0.762; 43 5.613,1.245; 44 5.613,1.753; 45 5.613,2.261; 46 5.613,2.743; 47 5.613,3.251; 48 5.613,3.759 | smd 0.279 x 1.473: 17 -3.759,-5.613; 18 -3.251,-5.613; 19 -2.743,-5.613; 20 -2.261,-5.613; 21 -1.753,-5.613; 22 -1.245,-5.613; 23 -0.762,-5.613; 24 -0.254,-5.613; 25 0.254,-5.613; 26 0.762,-5.613; 27 1.245,-5.613; 28 1.753,-5.613; 29 2.261,-5.613; 30 2.743,-5.613; 31 3.251,-5.613; 32 3.759,-5.613; 49 3.759,5.613; 50 3.251,5.613; 51 2.743,5.613; 52 2.261,5.613; 53 1.753,5.613; 54 1.245,5.613; 55 0.762,5.613; 56 0.254,5.613; 57 -0.254,5.613; 58 -0.762,5.613; 59 -1.245,5.613; 60 -1.753,5.613; 61 -2.261,5.613; 62 -2.743,5.613; 63 -3.251,5.613; 64 -3.759,5.613
LQFP-48 = smd 0.3 x 1: 1 -2.75,-4.25; 2 -2.25,-4.25; 3 -1.75,-4.25; 4 -1.25,-4.25; 5 -0.75,-4.25; 6 -0.25,-4.25; 7 0.25,-4.25; 8 0.75,-4.25; 9 1.25,-4.25; 10 1.75,-4.25; 11 2.25,-4.25; 12 2.75,-4.25; 25 2.75,4.25; 26 2.25,4.25; 27 1.75,4.25; 28 1.25,4.25; 29 0.75,4.25; 30 0.25,4.25; 31 -0.25,4.25; 32 -0.75,4.25; 33 -1.25,4.25; 34 -1.75,4.25; 35 -2.25,4.25; 36 -2.75,4.25 | smd 1 x 0.3: 13 4.25,-2.75; 14 4.25,-2.25; 15 4.25,-1.75; 16 4.25,-1.25; 17 4.25,-0.75; 18 4.25,-0.25; 19 4.25,0.25; 20 4.25,0.75; 21 4.25,1.25; 22 4.25,1.75; 23 4.25,2.25; 24 4.25,2.75; 37 -4.25,2.75; 38 -4.25,2.25; 39 -4.25,1.75; 40 -4.25,1.25; 41 -4.25,0.75; 42 -4.25,0.25; 43 -4.25,-0.25; 44 -4.25,-0.75; 45 -4.25,-1.25; 46 -4.25,-1.75; 47 -4.25,-2.25; 48 -4.25,-2.75
SOT-223B = smd 1.092 x 1.295: 1 2.311,-3.15; 2 -2.311,-3.15; 3 0,-3.15 | smd 3.505 x 1.295: 4 0,3.15
SOT-23 = smd 0.991 x 1.194: 1 -1.016,1.143; 2 1.016,1.143; 3 0,-1.143
MA18-1 = drill 1 octagon: 1 0,21.59; 2 0,19.05; 3 0,16.51; 4 0,13.97; 5 0,11.43; 6 0,8.89; 7 0,6.35; 8 0,3.81; 9 0,1.27; 10 0,-1.27; 11 0,-3.81; 12 0,-6.35; 13 0,-8.89; 14 0,-11.43; 15 0,-13.97; 16 0,-16.51; 17 0,-19.05; 18 0,-21.59
1206@2 = smd 1.143 x 1.702: 1 -1.473,0; 2 1.473,0
LED_0603 = smd 0.9 x 0.8: A 0,-0.75; C 0,0.75
TXC1 = smd 1.7 x 2.4: 1 -1.85,0; 2 1.85,0
SW_PTS840P = smd 1.65 x 1: 1 -1.9,0.75; 2 1.9,0.75; 3 -1.9,-0.75; 4 1.9,-0.75
7499011121A = drill 0.9 pad 1.397: 1 4.445,-6.35; 2 3.175,-8.89; 3 1.905,-6.35; 4 0.635,-8.89; 5 -0.635,-6.35; 6 -1.905,-8.89; 7 -3.175,-6.35; 8 -4.445,-8.89 | drill 1.02 pad 1.397: 9 6.63,4.08; 10 4.09,4.08; 11 -4.09,4.08; 12 -6.63,4.08 | drill 1.6: SH@1 -7.745,-3.05; SH@2 7.745,-3.05 | hole 3.25: 5.715,0; -5.715,0
SD_5031821853 = smd 0.65 x 1.6: CS 2.75,0.8; DAT1 -3.85,0.8; DAT2 3.85,0.8; GND -1.65,0.8; MISO -2.75,0.8; MOSI 1.65,0.8; SCK -0.55,0.8; VCC 0.55,0.8 | smd 1 x 1.2: SW1 -6,12.45; SW2 -6,3.3
SOT23 = smd 1.3 x 0.9: 1 -1.1,0.95; 2 -1.1,-0.95; 3 1.1,0

### Placement (x,y rotation side)
C1  35.56,15.88 0 top
C2  23.49,19.84 270 top
C3  40.32,25.72 90 top
C4  30,15.24 0 top
C5  31.91,32.07 180 top
C6  40.32,22.7 90 top
C7  23.49,21.11 270 top
C8  32.86,15.24 0 top
C9  35.08,32.13 180 top
C10  37.94,12.54 180 top
C11  37.94,9.37 0 top
C12  18.26,11.78 90 top
C13  1.26,16.51 180 top
C14  1.26,13.49 0 top
C15  7.11,2.44 270 top
C16  7.11,3.46 270 top
C17  3.18,7.84 270 top
C18  3.18,10.26 270 top
C19  19.21,33.18 270 top
C20  3.18,11.4 270 top
C21  19.21,20.95 270 top
C22  7.3,16.03 180 top
C23  10,16.03 180 top
C24  19.21,29.37 270 top
C25  19.21,25.56 270 top
C26  12.38,16.03 180 top
C27  19.21,28.1 90 top
C28  17.94,15.4 90 top
C29  19.21,26.83 90 top
C30  3.18,4.29 270 top
C31  3.18,6.7 270 top
C32  9.14,3.46 90 top
C33  48.42,3.97 270 top
C34  53.5,33.81 90 top
C35  51.28,3.97 90 top
C36  53.5,29.05 90 top
C37  52.55,32.07 90 top
C38  52.55,30.8 90 top
C39  3.18,9.05 270 top
C40  16.51,18.41 270 top
CON4  30.8,10 180 top
IC1  31.75,23.65 180 top
IC2  10.16,9.05 180 top
IC4  46.67,30.48 90 top
IC9  23.49,30.32 270 top
J1  32.73,37.43 90 top
J2  32.73,1.75 90 top
L1  18.26,13.81 180 top
L2  17.94,4.6 180 top
POWER  41.43,34.45 90 top
Q1  35.56,10.95 270 top
Q2  3.65,14.92 90 top
R1  24.61,18.57 90 top
R5  5.87,14.92 0 top
R6  3.18,5.56 270 top
R7  16.35,7.94 90 top
R8  16.35,9.53 90 top
R9  1.91,18.57 90 top
R10  4.92,18.57 90 top
R11  19.21,30.64 270 top
R12  19.21,31.91 270 top
R13  19.21,22.23 270 top
R14  19.21,23.49 270 top
R15  8.73,16.03 0 top
R17  26.04,30.32 0 top
R18  30.48,5.24 270 top
R19  27.62,12.22 270 top
R22  51.91,22.38 180 top
R23  53.18,22.38 180 top
R24  48.1,22.38 180 top
R25  45.56,22.38 180 top
R26  49.37,22.38 180 top
R27  50.64,22.38 180 top
R28  46.83,22.38 180 top
R29  54.31,22.38 0 top
R30  48.36,34.45 90 top
R35  27.62,5.24 90 top
RESET  56.23,25.19 90 top
RJ1  5.87,27.3 90 top
SD  56.11,21.38 90 top
SD1  56.61,11.14 90 top
T1  52.15,25.41 0 top

### Tracks (layer width: path | path; a pad name or v marks a point on that pad's centre or on a via)
+1,8V_A
  Top 0.152: 35.51,16.57 C1.1 | 32,31.44 C5.1 | 30.51,19.21 30.48,19.21 | 39.7,25.41 arc90 C3.1 | IC1.8 35.94,23.4
  Top 0.254: 35.51,16.57 IC1.64 35.51,19.53 | 32,31.44 IC1.24 32,28.1 | 30.51,19.21 IC1.54 30.51,16.85 30,16.35 30,15.84 C4.1 | 39.7,25.41 IC1.12 35.4,25.41 | C4.1 30,15.72 30.07,15.72 | 30.07,15.79 C4.1
  Top 0.3: R1.2 26.7,18.57 27.4,19.27 27.53,19.27
  pour Top: 36.2,19.21 36.2,28.1 27.3,28.1 27.3,19.21
+3,3V  (via drill 0.2 pad 0.46)
  Top 0.152: 19.57,4.4 19.84,4.76 | 24.16,21.39 C7.1 23.97,21.11 | IC4.3 50.14,30.48 | 46.83,23.02 v46.83,23.81 | R28.2 46.83,23.02 | 46.83,23.02 47.78,23.02 47.79,23.01 48.1,23.01 48.1,23.02 | 51.75,23.02 53.18,23.02 R23.2 | 51.75,23.02 50.64,23.02 | 50.64,23.02 49.37,23.02 | 49.37,23.02 48.1,23.02 | R27.2 50.64,23.02 | R22.2 51.75,23.01 51.75,23.02 | v26.04,31.75 26.04,30.8 25.88,30.8 25.4,31.27 24.64,31.27 | R26.2 49.37,23.02 | 48.1,23.02 R24.2 | v56.2,20.49 56.2,20.72 SD.A
  Top 0.16: R17.1 25.88,30.8
  Top 0.254: IC1.45 24.16,21.39 | 23.97,21.11 24.29,20.8 v24.77,20.8 | 24.64,31.27 IC9.1 | 49.21,3.97 C33.1 | IC1.58 32.51,17.02 v32.86,16.67 C8.1 32.86,15.73 | IC1.7 v38.86,22.89 38.89,22.89 39.08,22.7 C6.1 39.8,22.7 | IC1.18 35,30.59 v35.05,30.64 35.05,31.7 C9.1 | R35.2 v29.05,5.24 R18.2 | R19.2 v26.19,12.22
  Top 0.3: 19.84,4.76 L2.1 | 19.57,13.77 19.57,11.87 C12.2
  Top 0.305: L1.1 v18.42,13.81
  Top 0.406: L1.1 19.57,13.77 19.69,13.81 | 19.69,5.08 19.53,4.6 19.69,4.76 L2.1 19.57,4.4 | 50.14,30.48 v50.83,30.48 51.9,30.48 C38.1 51.92,30.78 51.92,29.05 52.07,28.89 52.13,28.99 52.36,28.99 C36.1 | v50.64,5.08 50.64,3.97 C35.1 49.21,3.97 | SD1.VCC 51.86,11.69 v51.44,11.27
  Top 0.61: 19.69,13.81 19.69,7.59 | 19.69,7.59 19.69,5.08 | CON4.8 19.81,7.46 19.69,7.59
  Bottom 0.16: v56.2,20.49 56.2,17.08 51.4,12.29 51.4,11.3 v51.44,11.27
  Bottom 0.406: v51.44,11.27 51.4,11.27 51.4,5.84 v50.64,5.08
  pour ROUTE2: 1.27,20 1.27,37.46 2.38,38.58 11.91,38.58 12.38,38.1 12.38,36.67 12.86,36.2 57.31,36.2 57.31,4.45 51.28,4.45 51.28,5.08 52.07,5.87 52.07,11.59 51.75,11.91 51.12,11.91 50.8,11.59 50.8,6.19 50.01,5.4 50.01,4.45 49.85,4.45 47.78,6.51 47.78,28.73 47.47,28.73 47.47,6.35 49.69,4.13 57.31,4.13 57.31,2.86 21.43,2.86 21.43,35.72 11.91,35.72 10.32,34.13 9.05,34.13 7.14,36.04 3.65,36.04 3.65,20
+5V
  Top 0.2: R30.2 49.69,34.45 49.82,34.58 | IC4.1 49.82,34.58 | 49.82,34.58 50.01,34.77
  pour Top: 49.37,34.77 49.37,32.23 50.01,31.59 52.55,31.59 52.55,32.23 53.82,33.5 53.82,34.77 55.72,36.67 55.72,38.58 52.55,38.58 52.55,37.94
A+3,3V  (via drill 0.2 pad 0.46)
  Top 0.152: 15.56,28.1 14.92,28.1 RJ1.4
  Top 0.16: C27.1 15.56,28.1 | C22.1 v7.3,14.61 7.91,14 IC2.11 | IC2.8 9.41,14.33 v9.68,14.61 9.68,15.56 10,15.56 C23.1 | IC2.4 11.43,13.49 11.41,13.51 11.41,14.11 11.91,14.61 v12.07,14.61 12.07,15.4 12.15,15.48 C26.1 | 12.38,15.56 C26.1 | 12.38,15.4 C26.1
  Top 0.254: IC2.15 5.24,10.8 v4.76,11.27 4.64,11.4 C20.1 | IC2.17 5.22,9.8 v4.76,10.26 C18.1 | IC2.21 4.81,7.8 v4.76,7.84 C17.1
  Top 0.305: v16.57,15.4 C28.1 | L1.2 16.51,13.81 16.62,13.93 16.62,15.35
  Top 0.406: 16.62,15.35 v16.57,15.4
  pour ROUTE2: 0.79,2.54 5.71,2.54 5.71,5.4 8.73,8.41 13.18,8.41 14.13,7.46 18.41,7.46 19.21,8.26 19.21,15.56 21.11,17.46 21.11,33.81 20.48,34.45 12.54,34.45 9.05,30.96 9.05,24.13 11.59,21.59 11.59,18.57 10.79,17.78 0.79,17.78
AREF  (via drill 0.2 pad 0.46)
  Top 0.152: v36.83,17.94 37.78,18.89 37.78,19.84 37.31,19.84 IC1.1
  ROUTE2 0.152: 22.23,1.75 25.08,4.6 30.48,4.6 33.97,8.1 33.97,15.08 v36.83,17.94
  ROUTE2 0.16: 22.23,1.75 J2.5
CRYP_SDA
  Top 0.152: IC1.35 25.2,26.4 24.69,26.91 IC1.34 | 24.65,26.94 24.61,26.99 24.61,29.21 24.64,29.24 IC9.2
  Top 0.16: 24.64,29.37 25.42,29.37 25.42,29.38 25.88,29.85 R17.2 | 24.69,26.91 24.65,26.94
  Top 0.254: 24.64,29.37 IC9.2
D+3,3V  (via drill 0.2 pad 0.46)
  Top 0.3: R8.2 v17.78,9.53 | C16.1 C15.1 | 8.73,3.65 C32.1 8.57,3.49 | 8.65,3.51 8.65,3.41 8.57,3.49 | 8.57,3.49 v8.57,2.54
  Top 0.305: L2.2 16.35,4.29 16.51,4.13 16.51,4.29 v17.62,4.29 | C16.1 C32.1 | IC2.28 8.91,3.83 8.73,3.65
  Bottom 0.16: 8.6,2.57 v8.57,2.54
  Bottom 0.3: v17.78,9.53 17.15,8.89 17.15,4.76 v17.62,4.29 | 11.08,4.45 10.48,4.45 8.6,2.57
  Bottom 0.305: v17.62,4.29 17.15,3.81 13.65,3.81 13.02,4.45 11.08,4.45
ETH_CS  (via drill 0.2 pad 0.46)
  Top 0.152: IC2.32 10.91,5.67 v11.11,5.87 | IC1.28 30,28.25 29.53,27.78 v29.53,27.46
  ROUTE2 0.152: v29.53,27.46 27.78,27.46 25.56,25.24 24.29,25.24 22.7,23.65 22.7,18.73 19.37,15.4 19.37,7.62 19.05,7.3 13.81,7.3 13.02,6.51 11.75,6.51 v11.11,5.87
ETH_INT  (via drill 0.2 pad 0.46)
  Top 0.152: v15.24,4.6 14.61,5.24 13.81,5.24 13.49,4.92 12.91,4.92 IC2.36
  Top 0.254: IC1.63 35,19.45 v34.93,19.53
  ROUTE2 0.152: v34.93,19.53 34.29,18.89 33.02,18.89 31.12,16.99 24.13,16.99 21.75,14.61 21.75,6.83 19.84,4.92 15.56,4.92 v15.24,4.6
ETH_RES  (via drill 0.2 pad 0.46)
  Top 0.152: IC2.37 13.7,6.3 13.18,6.83 v13.18,7.62 | IC1.59 32.99,19.55 v33.02,19.53
  ROUTE2 0.152: v33.02,19.53 30.96,17.46 23.97,17.46 21.27,14.76 21.27,6.99 19.69,5.4 15.08,5.4 v14.29,4.6
  Bottom 0.152: v13.18,7.62 14.29,6.51 v14.29,4.6
GND  (via drill 0.2 pad 0.46)
  Top 0.152: 7.28,11.3 v7.3,11.27 | 7.28,10.3 v7.3,10.32 | 35.64,20.4 v35.56,20.48 | IC1.60 33.5,19.04 v33.97,19.53 | R7.2 v17.78,7.94 | R6.2 v1.59,5.56 | 38.1,11.91 C10.1 37.94,10.95 | 37.94,10.95 v36.83,10.95 | C11.1 37.94,10.95 | IC4.2 49.91,28.26 | C27.2 C29.2 | IC9.3 22.23,30.32 v22.23,31.43 | T1.2 51.07,24.45 v49.76,24.45 | POWER.C v39.69,34.45 | IC1.2 38.34,20.4 38.58,20.16 38.58,19.53 38.26,19.21 38.26,18.42 v36.83,16.99
  Top 0.16: C21.2 v17.78,20.96 | C27.2 v20.64,28.1 | C19.2 v17.78,33.18 | C13.1 1.26,14.92 | 1.26,14.92 C14.1 | v2.06,14.92 1.26,14.92
  Top 0.254: IC1.2 35.64,20.4 | IC1.17 35.51,27.73 v35.56,27.46 | IC1.46 27.51,20.91 v27.62,21.11 | C4.2 v30,13.81 | C8.2 v32.86,13.84 | C5.2 v31.91,33.56 | C9.2 v35.08,33.56 | C15.2 6.65,2.53 | C39.2 1.65,9.05 v1.59,8.99 | C1.2 v35.56,14.45 | C6.2 40.96,22.7 | 40.96,22.7 40.99,22.67 40.77,22.67 40.96,22.7 | 40.96,22.7 v41.75,22.7
  Top 0.3: C12.1 v18.13,11.78 | v6.7,4.35 6.64,4.29 6.64,4.25 | 6.65,2.53 6.62,2.56 | IC2.29 9.41,3.77 9.68,3.49 C32.2 | C3.2 v41.75,25.72 | 6.62,3.45 C16.2 6.51,3.49 6.62,3.45
  Top 0.305: C17.2 v1.59,7.84 | C31.2 v1.59,6.7 | C18.2 v1.59,10.26 | C20.2 v1.59,11.4 | C22.2 v7.3,17.46 7.4,17.37 | 9.91,16.54 10.03,16.69 C23.2 v10,17.46 | IC2.48 13.23,11.8 v13.02,11.59 | IC2.3 11.91,12.06 v12.07,11.91 | IC2.9 8.91,12.24 v9.21,11.91 | IC2.14 7.28,11.3 | IC2.16 7.28,10.3 | IC2.29 9.41,5.99 v9.21,6.19 | IC2.19 7.05,8.8 v7.3,9.05 | R15.1 v8.73,17.46 | C2.2 22.85,19.86 23.02,20 23.02,21.1 | v12.38,17.46 C26.2 | C30.2 v1.59,4.29 | 6.64,4.25 6.62,3.45 6.62,2.56 | 18.57,15.42 18.57,15.4 18.49,15.29 C28.2 18.51,15.42 18.51,15.97 18.64,16.1 v18.64,16.48 | C40.1 v17.94,18.42
  Top 0.406: 49.91,28.26 v50.83,28.26 | C38.2 54.13,30.8 v54.29,30.64 55.22,29.72 C36.2 54.95,29 56.38,29 56.98,28.4 RESET.4 RESET.3 | C37.2 54.13,32.07 v54.29,32.23 54.9,32.83 C34.2 | v22.07,21.11 C7.2 23.02,21.1
  ROUTE2 0.152: 23.81,2.7 25.24,4.13 30.64,4.13 34.45,7.94 34.45,14.92 36.51,16.99 v36.83,16.99
  ROUTE2 0.16: 23.81,2.7 23.81,1.78 J2.6
  ROUTE3 0.3: v18.13,11.78 18.38,11.78
  other vias: 54.29,9.05 45.72,5.87 52.07,5.08
  pour ROUTE3: 21.43,36.67 21.43,16.03 21.11,16.03 21.11,33.81 20.48,34.45 12.54,34.45 9.05,30.96 9.05,24.13 11.59,21.59 11.59,18.57 10.79,17.78 0.79,17.78 0.79,2.54 5.71,2.54 5.71,5.4 8.73,8.41 13.18,8.41 14.45,7.14 21.11,7.14 21.11,13.18 21.43,13.18 21.43,6.83 14.29,6.83 13.02,8.1 8.89,8.1 6.03,5.24 6.03,2.54 52.86,2.54 52.86,0.63 55.72,0.63 55.72,2.54 57.31,2.54 57.31,4.13 49.69,4.13 47.47,6.35 47.47,28.73 47.78,28.73 47.78,6.51 49.85,4.45 57.31,4.45 57.31,36.67
  pour Top: 41.28,19.84 57.31,19.84 57.31,3.18 41.28,3.18
JTAGSL
  Top 0.152: IC1.50 28.5,16.91 24.45,12.86 24.45,8.73 CON4.6
MISO  (via drill 0.2 pad 0.46)
  Top 0.152: IC2.34 11.91,5.72 v12.07,5.87 | IC1.27 30.51,28.12 30.16,27.78 v30.16,26.83
  ROUTE2 0.152: v30.16,26.83 27.78,26.83 25.72,24.77 24.45,24.77 23.18,23.5 23.18,18.57 19.84,15.24 19.84,7.46 19.21,6.83 13.97,6.83 13.02,5.87 v12.07,5.87
MOSI  (via drill 0.2 pad 0.46)
  Top 0.152: 33.15,27.01 v33.18,26.51 33.18,28.1 32.99,28.28 IC1.22 | IC2.35 12.41,4 v12.07,3.65
  ROUTE2 0.152: v33.18,26.51 33.02,26.51 32.23,25.72 27.94,25.72 25.24,23.02 24.45,23.02 24.13,22.7 24.13,18.26 20.8,14.92 20.8,7.14 19.53,5.87 14.29,5.87 v12.07,3.65
N$1  (via drill 0.2 pad 0.46)
  Top 0.152: IC2.25 7.41,5.98 8.26,6.83 v8.26,9.68
  Top 0.16: v3.33,18.57 2.38,18.57 2.6,18.48 2.54,18.42 R9.2
  Bottom 0.152: v8.26,9.68 8.26,11.27 5.72,13.81 5.72,16.51
  Bottom 0.16: 5.72,16.51 5.72,18 5.14,18.57 v3.33,18.57
N$2
  Top 0.152: IC2.45 IC2.44 | IC2.43 IC2.44 | IC2.44 15.61,9.8 R8.1
N$3
  Top 0.152: R29.1 54.31,24.61 53.66,25.24 53.49,25.41 T1.3
N$4  (via drill 0.2 pad 0.46)
  Top 0.152: v4.29,14.92 4.29,13.02 Q2.1 3.81,13.02 1.27,13.02 C14.2 | IC2.31 10.41,7.39 v10.16,7.78
  Top 0.16: R5.2 5.87,14.45 5.72,14.45 4.29,13.02
  ROUTE2 0.152: v4.29,14.92 3.81,14.45 3.81,6.03 4.13,5.72 7.14,5.72 9.21,7.78 v10.16,7.78
N$5  (via drill 0.2 pad 0.46)
  Top 0.152: C13.2 1.11,16.99 3.02,16.99 | 3.02,16.83 Q2.2 4.29,16.77 3.97,16.99 | 3.02,16.83 v3.02,14.92 | IC2.30 9.91,6.76 v9.53,7.14 | 3.33,17.15 3.02,16.99 | 3.02,16.99 3.02,16.83
  Top 0.16: R5.1 5.87,15.4 4.6,16.67 3.6,16.83 Q2.2
  ROUTE2 0.152: v3.02,14.92 3.33,14.61 3.33,5.87 3.97,5.24 7.3,5.24 9.21,7.14 v9.53,7.14
N$6
  Top 0.254: IC2.23 5.24,6.8 4.7,6.25 4.7,5.87 4.45,5.62 3.89,5.62 R6.1
N$7  (via drill 0.2 pad 0.46)
  Top 0.152: IC2.27 8.41,6.35 8.89,6.83 8.89,9.37 v9.21,9.68 | v6.35,18.57 5.56,18.57
  Top 0.16: 5.56,18.57 R10.2
  Bottom 0.152: v9.21,9.68 8.89,10 8.89,11.27 6.19,13.97 6.19,18.42
  Bottom 0.16: 6.19,18.42 v6.35,18.57
N$10
  Top 0.3: 24.12,18.57 R1.1 23.97,18.57 24.05,18.65 C2.1
N$11
  Top 0.152: IC2.38 IC2.39 IC2.40 | IC2.42 IC2.41 IC2.40 | IC2.40 16.02,7.8 R7.1
N$16
  Top 0.152: IC2.10 8.41,15.56 R15.2
N$17
  Top 0.254: IC2.22 5.11,7.3 4.57,6.76 3.89,6.76 C31.1
N$18  (via drill 0.2 pad 0.46)
  Top 0.254: IC2.20 5.2,8.3 4.45,9.05 C39.1
  Top 0.305: IC2.20 7.1,8.3 v7.3,8.1 | v4.76,4.29 3.81,4.3
  Top 0.406: 3.81,4.3 C30.1
  ROUTE3 0.305: v7.3,8.1 4.76,5.56 v4.76,4.29
N$19
  Top 0.152: R12.1 R11.1
  Top 0.16: R12.1 C19.1
N$21
  Top 0.152: R14.1 R13.1 C21.1
N$24  (via drill 0.2 pad 0.46)  (1 unrouted)
  Top 0.61: 42.86,32.39 44.29,32.39 44.29,28.58 42.86,28.58 42.86,32.23
  other vias: 44.77,31.12 44.77,31.75 44.77,32.38 44.77,30.48 44.77,29.84 44.77,29.21 44.77,28.57 42.23,32.38 42.23,31.75 42.23,31.12 42.23,30.48 42.23,29.84 42.23,29.21 42.23,28.57
  pour Top (no thermals): 37.31,33.66 48.58,33.66 48.58,24.77 37.31,24.77
N$26
  Top 0.152: R9.1 1.39,18.77 0.48,19.69 0.48,30.08 RJ1.10
N$27
  Top 0.152: R10.1 4.39,18.52 4.45,18.73 | 4.37,18.42 4.45,18.73 | 4.45,18.73 2.5,20.68 RJ1.12
N$31
  Top 0.356: 3.33,28.26 3.33,27.62
N$32
  Top 0.356: 3.33,26.99 3.33,26.35
N$33
  Top 0: 8.41,26.99 9.05,27.62
  Top 0.016: 4.29,28.58 4.6,28.26 5.24,28.26 | 4.6,27.62 4.6,26.99 | 5.24,28.26 5.24,26.99 | 5.24,26.35 5.56,26.04 | 5.24,28.26 5.56,28.58 | 6.19,28.58 6.51,28.26 7.21,28.26 7.14,28.19 7.14,27.62 7.14,26.99 | 6.19,26.04 6.51,26.35 | 7.14,28.26 7.46,28.58 | 7.14,26.35 7.46,26.04 | 8.1,26.04 8.41,26.35 | 9.05,27.62 9.37,27.31 | 9.05,28.26 9.37,28.58 | 10,27.31 10.32,26.99 | 10.32,26.35 10,26.04 | 6.51,27.62 6.51,27.05 6.57,26.99
  Top 0.356: 4.6,26.35 4.6,26.99 | 4.6,27.62 4.6,28.26 | 4.29,28.58 3.65,28.58 | 5.24,26.35 5.24,26.99 | 6.51,26.35 6.51,26.99 | 5.24,27.62 5.24,28.26 | 6.51,27.62 6.51,28.26 | 6.19,28.58 5.56,28.58 | 6.19,26.04 5.56,26.04 | 7.14,26.35 7.14,26.99 | 7.14,27.62 7.14,28.26 | 8.1,26.04 7.46,26.04 | 8.41,26.99 8.41,26.35 | 7.46,28.58 8.1,28.58 | 9.05,27.62 9.05,28.26 | 10,27.31 9.37,27.31 | 10,28.58 9.37,28.58 | 10,26.04 9.37,26.04 | 10.32,26.99 10.32,26.35
N$39
  Top 0.152: R30.1 POWER.A
N$40
  Top 0.152: SD.C 55.24,21.23 55.25,21.27 54.68,21.83 R29.2
N$41
  Top 0.152: R25.1 R28.1
  Top 0.16: SD1.SW2 53.21,5.14 47.59,10.76 47.59,20.03 46.83,20.8 R28.1
NRST  (via drill 0.2 pad 0.46)
  Top 0.152: IC1.39 25.05,24.42 v24.77,24.13 | RESET.2 RESET.1 55.48,27.16 55.47,27.17 v54.12,27.17
  Bottom 0.152: CON4.4 26.99,8.73 26.99,13.18 26.35,13.81 26.35,22.54 v24.77,24.13 25.44,24.81 25.44,26.71 24.53,27.63 24.53,33.42 26.05,34.94 35.2,34.94 36.72,33.42 36.72,23.97 38.55,22.14 42.98,22.14 48.01,27.17 v54.12,27.17
PA0  (via drill 0.2 pad 0.46)
  Top 0.152: IC1.48 27.99,19.89 29.21,21.11 v29.21,22.07 | v27.62,32.94 22.43,32.94 19.82,35.55 18.1,35.55 J1.3
  Bottom 0.152: v29.21,22.07 29.05,22.23 29.05,25.24 27.94,26.35 27.94,32.62 v27.62,32.94
PA1  (via drill 0.2 pad 0.46)
  Top 0.152: IC1.47 27.86,20.4 28.58,21.11 v28.58,21.43 | v26.99,33.57 22.63,33.57 J1.4
  Bottom 0.152: v28.58,21.43 28.58,24.92 27.46,26.04 27.46,32.14 26.99,32.62 v26.99,33.57
PA2  (via drill 0.2 pad 0.46)
  Top 0.152: IC1.44 27.78,21.9 v27.94,22.07 | v26.35,34.21 24.53,34.21 J1.5
  Bottom 0.152: v27.94,22.07 28.1,22.23 28.1,24.77 26.99,25.88 26.99,31.99 26.35,32.62 v26.35,34.21
PA3  (via drill 0.2 pad 0.46)
  Top 0.152: IC1.43 24.9,22.41 v24.77,22.38
  Bottom 0.152: 23.65,37.31 23.65,23.5 v24.77,22.38
  Bottom 0.16: 23.65,37.31 23.72,37.31 J1.6
PA4  (via drill 0.2 pad 0.46)
  Top 0.152: IC1.36 24.8,25.91 v24.77,25.88
  Bottom 0.152: v24.77,25.88 24.13,26.51 24.13,35.08 26.35,37.31
  Bottom 0.16: 26.35,37.31 26.35,37.4 J1.7
PA7
  Top 0.152: IC1.32 27.99,30.69 28.89,31.59
  Top 0.16: 28.89,31.59 28.89,37.4 J1.8
PA8
  Top 0.152: 31.43,37.31 29.37,35.24 29.37,31.43 28.5,30.56 IC1.31
  Top 0.16: 31.43,37.31 31.43,37.4 J1.9
PA9
  Top 0.152: 33.97,37.31 33.81,37.31 32.86,36.35 31.12,36.35 29.85,35.08 29.85,31.27 29.01,30.44 IC1.30
  Top 0.16: 33.97,37.31 33.97,37.4 J1.10
PA10
  Top 0.152: 34.93,35.88 31.27,35.88 30.32,34.93 30.32,31.12 29.49,30.28 IC1.29
  Top 0.16: 34.93,35.88 34.99,35.88 J1.11
PA15
  Top 0.152: IC1.20 34.01,30.28 33.81,30.48 33.81,33.97 35.88,36.04 37.78,36.04 39.05,37.31
  Top 0.16: 39.05,37.31 39.05,37.4 J1.12
PA16
  Top 0.152: IC1.19 34.49,30.44 34.29,30.64 34.29,33.81 36.04,35.56 39.85,35.56 41.59,37.31
  Top 0.16: 41.59,37.31 41.59,37.4 J1.13
PA17  (via drill 0.2 pad 0.46)
  Top 0.152: IC1.9 38.48,23.91 38.74,23.65 v40.32,23.65
  Top 0.16: v44.13,35.08 44.13,37.4 J1.14
  Bottom 0.152: v40.32,23.65 40.32,25.72 40.96,26.35 40.96,26.99 40.8,27.15 40.8,33.02 42.86,35.08 v44.13,35.08
PA18  (via drill 0.2 pad 0.46)
  Top 0.152: IC1.10 38.61,24.42 38.74,24.29 40.64,24.29 v41.28,23.65
  Top 0.16: v46.67,35.08 46.67,37.4 J1.15
  Bottom 0.152: v41.28,23.65 41.28,25.24 41.12,25.4 41.12,26.04 41.43,26.35 41.43,27.15 41.28,27.31 41.28,32.7 43.02,34.45 46.04,34.45 v46.67,35.08
PA19  (via drill 0.2 pad 0.46)
  Top 0.152: IC1.13 38.46,25.91 39.21,26.67 v40.32,26.67
  Top 0.16: J1.16 49.24,35.59 v49.21,35.56
  Bottom 0.152: 49.05,35.72 42.7,35.72 40.32,33.34 v40.32,26.67
  Bottom 0.16: 49.05,35.72 v49.21,35.56
PA20  (via drill 0.2 pad 0.46)
  Top 0.152: IC1.16 38.21,27.41 39.21,28.42 v39.53,28.42
  Bottom 0.152: 50.48,36.2 42.39,36.2 39.85,33.66 39.85,28.73 v39.53,28.42
  Bottom 0.16: 50.48,36.2 50.55,36.2 J1.17
PA21  (via drill 0.2 pad 0.46)
  Top 0.152: IC1.11 38.76,24.9 38.89,24.77 41.12,24.77 42.39,23.65 42.39,22.23 42.07,21.91 41.43,21.91 40.01,20.48 40.01,19.53 39.85,19.37 39.85,5.87 39.37,5.4 v39.37,3.81
  Bottom 0.152: v39.37,3.81 39.69,3.49 42.39,3.49
  Bottom 0.16: 42.39,3.49 42.42,3.49 J2.14
PA22  (via drill 0.2 pad 0.46)
  Top 0.152: IC1.14 38.3,26.4 39.21,27.31 41.28,27.31 42.86,25.72 42.86,22.07 42.23,21.43 41.59,21.43 40.48,20.32 40.48,19.53 40.32,19.37 40.32,5.72 40.01,5.4 v40.01,4.45
  Bottom 0.152: v40.01,4.45 40.48,3.97 44.45,3.97
  Bottom 0.16: 44.45,3.97 44.48,3.97 J2.15
PA23  (via drill 0.2 pad 0.46)
  Top 0.152: IC1.15 38.34,26.91 39.21,27.78 41.43,27.78 43.34,25.88 43.34,21.91 42.39,20.96 41.75,20.96 40.96,20.16 40.96,19.53 40.8,19.37 40.8,5.24 v40.64,5.08
  Bottom 0.152: v40.64,5.08 41.28,4.45 46.51,4.45
  Bottom 0.16: 46.51,4.45 46.55,4.45 J2.16
PA24  (via drill 0.2 pad 0.46)
  Top 0.152: IC1.23 32.51,27.59 v32.54,27.46
  Bottom 0.152: 48.42,5.08 41.59,5.08 38.42,8.26 38.42,20.96 33.66,25.72 32.86,25.72 32.54,26.04 v32.54,27.46
  Bottom 0.16: 48.42,5.08 48.45,5.08 J2.17
PB0  (via drill 0.2 pad 0.46)
  Top 0.152: IC1.3 38.46,20.91 39.05,20.32 39.05,19.53 38.89,19.37 38.89,6.19 38.1,5.4 v38.1,3.49
  Bottom 0.152: v38.1,3.49 38.58,3.02 40.32,3.02
  Bottom 0.16: 40.32,3.02 40.35,3.02 J2.13
PB1
  Top 0.152: IC1.4 38.61,21.39 39.53,20.48 39.53,19.53 39.37,19.37 39.37,6.03 38.74,5.4 38.74,2.06
  Top 0.16: 38.74,2.06 38.77,2.06 J2.12
PB2  (via drill 0.2 pad 0.46)
  Top 0.152: IC1.5 35.71,21.9 v35.56,21.75
  Bottom 0.152: 36.51,3.65 37.94,5.08 37.94,19.84 36.04,21.75 v35.56,21.75
  Bottom 0.16: 36.51,3.65 36.51,1.78 J2.11
PB3  (via drill 0.2 pad 0.46)
  Top 0.152: IC1.6 35.85,22.41 v35.56,22.7
  Bottom 0.152: 33.97,1.91 37.47,5.4 37.47,19.69 36.04,21.11 35.4,21.11 34.93,21.59 34.93,22.07 v35.56,22.7
  Bottom 0.16: 33.97,1.91 33.97,1.78 J2.10
PB10
  Top 0.152: 31.43,3.18 33.02,4.76 33.02,11.75 31.43,13.34 31.43,17.15 31.5,17.21 IC1.56
  Top 0.16: 31.43,3.18 31.43,1.78 J2.9
PB11  (via drill 0.2 pad 0.46)
  Top 0.152: v32.39,3.18 33.5,4.29 33.5,11.91 31.91,13.49 31.91,17.15 32,17.24 IC1.57
  Bottom 0.152: 30.32,3.18 v32.39,3.18
  Bottom 0.16: 30.32,3.18 30.32,3.14 J2.8
PB12
  Top 0.152: 27.78,3.18 30.8,3.18 32.54,4.92 32.54,11.59 30.96,13.18 30.96,17.15 30.99,17.18 30.99,17.91
  Top 0.16: IC1.55 30.99,17.91 | 27.78,3.18 27.78,3.14 J2.7
RX+  (via drill 0.2 pad 0.46)
  Top 0.152: IC2.6 10.41,14.54 10.95,15.08 10.95,17.78 12.54,19.37 v12.7,19.37
  Top 0.16: v17.78,22.23 R13.2 18.89,22.23 19.21,22.54 19.21,24.29 19.69,24.77 19.69,25.54 C25.1
  Bottom 0.152: v12.7,19.37 17.15,19.37 18.42,20.64 18.42,21.59 v17.78,22.23
RX+2
  Top 0.152: 15.56,25.56 14.92,25.56 RJ1.6
  Top 0.16: C25.2 15.56,25.56
RX-  (via drill 0.2 pad 0.46)
  Top 0.152: IC2.5 10.91,14.4 11.43,14.92 11.43,17.62 12.38,18.57 v12.7,18.57
  Top 0.16: v17.78,23.5 R14.2 18.72,23.5 | 18.73,23.5 18.72,23.5 | 18.72,23.5 18.72,24.43 19.21,24.92 19.21,28.72 C24.1
  Bottom 0.152: v12.7,18.57 13.02,18.89 17.3,18.89 18.89,20.48 18.89,22.38 v17.78,23.5
RX-2
  Top 0.152: 13.02,29.37 12.38,29.37 RJ1.3
  Top 0.16: C24.2 13.02,29.37
RXZ
  Top 0.152: 13.02,26.83 12.38,26.83 RJ1.5
  Top 0.16: C29.1 13.02,26.83
SCK  (via drill 0.2 pad 0.46)
  Top 0.152: IC2.33 11.41,3.95 v11.11,3.65 | IC1.21 33.5,28.25 33.81,27.94 v33.81,27.46
  ROUTE2 0.152: v33.81,27.46 33.34,27.46 32.07,26.19 27.78,26.19 25.08,23.5 24.29,23.5 23.65,22.86 23.65,18.42 20.32,15.08 20.32,7.3 19.37,6.35 14.13,6.35 12.22,4.45 11.91,4.45 v11.11,3.65
SD_CLK  (via drill 0.2 pad 0.46)
  Top 0.152: IC1.41 27.05,23.4 27.15,23.5 29.37,23.5 30.48,22.38 v30.8,22.38
  Top 0.16: SD1.SCK 51.32,10.59 49.05,12.86 v49.05,13.02
  ROUTE2 0.152: v30.8,22.38 33.66,22.38 35.08,23.81 36.04,23.81 36.67,23.18 36.67,21.59 43.82,14.45 47.63,14.45 v49.05,13.02
SD_CMD  (via drill 0.2 pad 0.46)
  Top 0.152: IC1.38 27.01,24.9 27.94,23.97 29.53,23.97 30.48,23.02 v31.43,23.02 | v50.64,20.96 R27.1
  Top 0.16: SD1.MOSI 50.23,12.79 v49.05,13.97
  ROUTE2 0.152: v31.43,23.02 33.66,23.02 34.93,24.29 36.2,24.29 37.15,23.34 37.15,21.75 43.97,14.92 48.1,14.92 v49.05,13.97
  Bottom 0.152: v49.05,13.97 50.17,15.08 50.17,20.48 v50.64,20.96
SD_DAT0  (via drill 0.2 pad 0.46)
  Top 0.152: IC1.42 27.18,22.89 27.31,23.02 29.21,23.02 30.48,21.75 v31.43,21.75 | v51.91,20.96 R22.1
  Top 0.16: SD1.MISO 52.72,8.39 v49.05,12.07
  ROUTE2 0.152: v31.43,21.75 33.66,21.75 35.24,23.34 35.88,23.34 36.2,23.02 36.2,21.43 43.66,13.97 47.15,13.97 v49.05,12.07
  Bottom 0.152: v49.05,12.07 49.69,12.7 49.69,13.81 50.64,14.76 50.64,19.69 v51.91,20.96
SD_DAT1  (via drill 0.2 pad 0.46)
  Top 0.152: IC1.52 29.49,19.81 v30,20.32 | v53.18,20.96 R23.1
  Top 0.16: SD1.DAT1 52.87,7.29 v49.05,11.11
  ROUTE2 0.152: v30,20.32 30.8,21.11 35.88,21.11 43.5,13.49 46.67,13.49 v49.05,11.11
  Bottom 0.152: v49.05,11.11 50.17,12.22 50.17,13.49 51.12,14.45 51.12,18.89 v53.18,20.96
SD_DAT2  (via drill 0.2 pad 0.46)
  Top 0.152: IC1.26 30.99,27.59 v30.8,27.46 | v48.1,20.96 R24.1
  Top 0.16: SD1.DAT2 49.93,14.99 v49.05,15.88
  ROUTE2 0.152: v31.43,24.29 33.66,24.29 34.61,25.24 36.51,25.24 38.1,23.65 38.1,22.07 44.29,15.88 v49.05,15.88
  Bottom 0.152: v30.8,27.46 30.8,24.92 v31.43,24.29 | v49.05,15.88 49.21,15.88 49.21,19.84 v48.1,20.96
SD_DAT3  (via drill 0.2 pad 0.46)
  Top 0.152: IC1.37 27.14,25.41 28.1,24.45 29.69,24.45 30.48,23.65 v30.8,23.65 | v49.37,20.96 R26.1
  Top 0.16: SD1.CS 50.08,13.89 v49.05,14.92
  ROUTE2 0.152: v30.8,23.65 33.66,23.65 34.77,24.77 36.35,24.77 37.62,23.5 37.62,21.91 44.13,15.4 48.58,15.4 v49.05,14.92
  Bottom 0.152: v49.05,14.92 49.69,15.56 49.69,20.48 v49.37,20.96
SD_DET  (via drill 0.2 pad 0.46)
  Top 0.152: IC1.25 31.5,27.88 31.43,27.78 v31.43,26.83 | R25.2 v45.56,23.81 | T1.1 51.07,26.35 v49.76,26.35
  Bottom 0.152: v31.43,26.83 31.43,27.31 32.23,28.1 34.13,28.1 34.61,27.62 34.61,25.4 38.26,21.75 43.5,21.75 v45.56,23.81 48.1,26.35 v49.76,26.35
SH1
  Top 0.152: 16.03,18.5 C40.2
  Top 0.305: RJ1.SH@1 11.11,21.75 14.29,21.75 16.03,20 16.03,18.5
  Bottom 0.152: 8.92,20.35 RJ1.SH@1 | 8.92,35.84 RJ1.SH@2
  Bottom 1.422: 8.92,20.35 8.92,35.84
TCK
  Top 0.152: IC1.53 30,17.14 28.89,16.03 28.89,13.65 29.53,13.02 29.53,9.05 29.21,8.73 26.99,8.73 | 26.99,8.73 CON4.5 | R35.1 26.99,5.24 26.99,8.73
TDI  (via drill 0.2 pad 0.46)
  Top 0.152: R18.1 31.59,5.72 32.07,6.19 32.07,8.73 CON4.1 | v26.04,28.42 26.04,27.46 26.05,27.5 IC1.33
  Bottom 0.152: CON4.1 26.83,13.97 26.83,25.4 26.04,26.19 v26.04,28.42
TDO
  Top 0.152: IC1.49 27.99,17.04 23.18,12.22 CON4.7
TMS
  Top 0.152: IC1.51 29.01,16.78 28.26,16.03 28.26,11.75 | 28.26,11.75 CON4.3 | R19.1 28.26,11.75
TX+  (via drill 0.2 pad 0.46)
  Top 0.152: IC2.2 12.41,14 13.34,14.92 13.34,20.48 13.81,20.96 v13.97,20.96 | 15.56,30.64 14.92,30.64 RJ1.2
  Top 0.16: R11.2 15.56,30.64
  Bottom 0.152: v13.97,20.96 15.08,20.96 16.67,22.54 16.67,29.85 16.03,30.48 RJ1.2
TX-  (via drill 0.2 pad 0.46)
  Top 0.152: IC2.1 12.91,13.86 13.81,14.76 13.81,20 v13.97,20.16 | 13.02,31.91 12.38,31.91 RJ1.1
  Top 0.16: R12.2 13.02,31.91
  Bottom 0.152: v13.97,20.16 14.92,20.16 17.15,22.38 17.15,30.16 15.56,31.75 RJ1.1
X1
  Top 0.152: Q1.2 34.98,9.68 34.93,9.68 34.77,9.53 33.97,10.32 33.97,16.99 34.01,17.02 IC1.61
  Top 0.16: C11.2 36.12,8.82 36.04,8.73 35.95,8.72 Q1.2
X2
  Top 0.152: 34.61,12.33 35.56,12.86 Q1.1 | IC1.62 34.49,17.03 34.45,16.99 34.45,13.49 34.77,13.18
  Top 0.16: C10.2 36.27,13.09 36.2,13.02 35.95,13.19 Q1.1 35.19,13.18 34.77,13.18

### Text on the board
ROUTE2: AR
ROUTE3: AR
tPlace: Power
bPlace: 3,3V | PA0 | PA1 | PA2 | PA3 | PA4 | PA7 | PA8 | PA9 | PA10 | PA15 | PA16 | PA17 | PA18 | PA19 | PA20 | 5V | ARef | AGND | PB12 | PB11 | PB10 | PB3 | PB2 | PB1 | PB0 | PA21 | PA22 | PA23 | PA24 | GND
tNames: Ethernet | CN1 | (c) AR | V1.0d | JTAG
Document: Link | Act